# Altium project bigpine.PrjPCB (part 1 of 2)
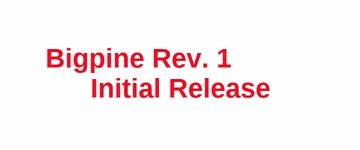
[diagram p0: 01-main.SchDoc]
Client: Amaya Tech, Inc.; ClientAddress: Lafayette, California; ClientProject: Big Pine Main PCB; Company: Amaya Tech, Inc.; CompanyAddress: Lafayette, California; CompanyEmail: joel@amaya.tech
14 sheets, 199 parts. Net scope: global (net labels, ports and power ports of the same name join across sheets).
Board file: bigpine.PcbDoc
Sheets:
  01-main.SchDoc
  02-mcu0.SchDoc
  03-mcu1.SchDoc
  04-mcu2.SchDoc
  05-mcu3.SchDoc
  14-misc.SchDoc
  13-connectors.SchDoc
  06-modem0.SchDoc
  10-power.SchDoc
  11-mppt.SchDoc
  12-sdcard.SchDoc
  07-modem1.SchDoc
  08-modem2.SchDoc
  09-modem3.SchDoc

## Sheet 01-main.SchDoc: Main
size Letter; DrawnBy: J. Brinton; Engineer: J. Brinton; Revision: 1; SheetNumber: 1; SheetTotal: 14

### Notes on the sheet
- Bigpine Rev. 1
- Initial Release
- Designed By:
- Title
- Engineer
- Revision
- Drawn By
- Date
- Sheet
- of

## Sheet 02-mcu0.SchDoc: MCU
size Letter; DrawnBy: J. Brinton; Engineer: J. Brinton; Revision: 1; SheetNumber: 2; SheetTotal: 14
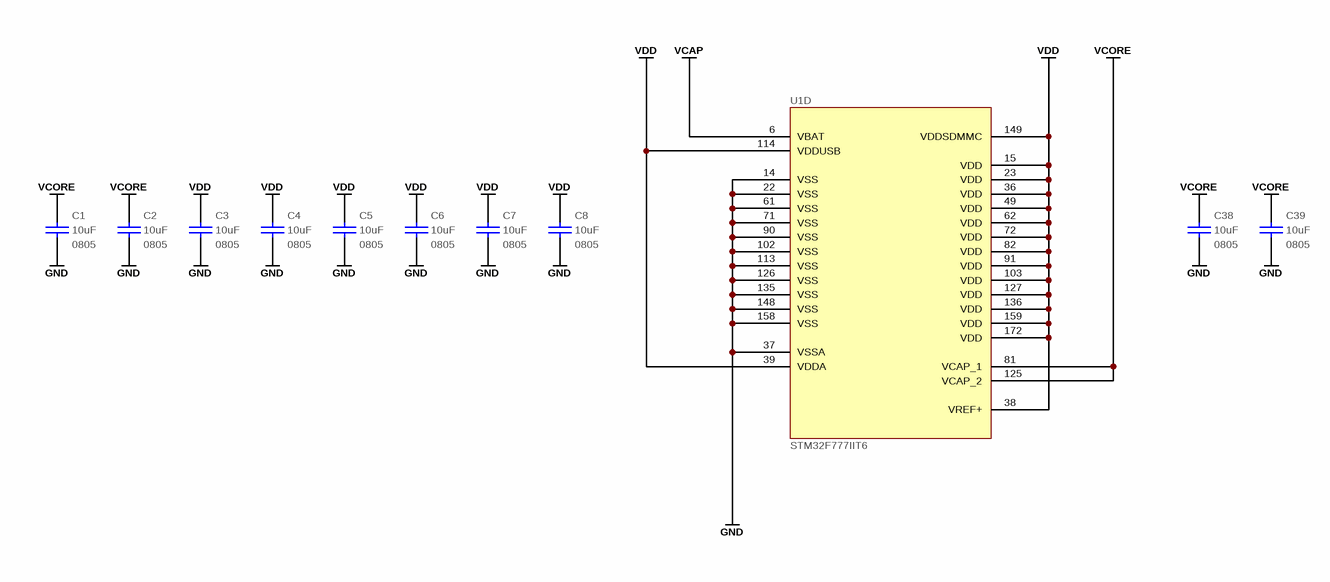
[diagram p1: 02-mcu0.SchDoc]

### Parts
C1  value 10uF  Package: 0805  [CAPC200X125X145L45N]  (hidden comment: CL21B106KOQNNNE)
C2  value 10uF  Package: 0805  [CAPC200X125X145L45N]  (hidden comment: CL21B106KOQNNNE)
C3  value 10uF  Package: 0805  [CAPC200X125X145L45N]  (hidden comment: CL21B106KOQNNNE)
C4  value 10uF  Package: 0805  [CAPC200X125X145L45N]  (hidden comment: CL21B106KOQNNNE)
C5  value 10uF  Package: 0805  [CAPC200X125X145L45N]  (hidden comment: CL21B106KOQNNNE)
C6  value 10uF  Package: 0805  [CAPC200X125X145L45N]  (hidden comment: CL21B106KOQNNNE)
C7  value 10uF  Package: 0805  [CAPC200X125X145L45N]  (hidden comment: CL21B106KOQNNNE)
C8  value 10uF  Package: 0805  [CAPC200X125X145L45N]  (hidden comment: CL21B106KOQNNNE)
C38  value 10uF  Package: 0805  [CAPC200X125X145L45N]  (hidden comment: CL21B106KOQNNNE)
C39  value 10uF  Package: 0805  [CAPC200X125X145L45N]  (hidden comment: CL21B106KOQNNNE)
U1  STM32F777IIT6  [TSQFP50P2600X2600X160-176N]  (part D of 4)

### Nets
GND: C1.2 C2.2 C3.2 C4.2 C5.2 C6.2 C7.2 C8.2 C38.2 C39.2 U1.14(VSS) U1.22(VSS) U1.37(VSSA) U1.61(VSS) U1.71(VSS) U1.90(VSS) U1.102(VSS) U1.113(VSS) U1.126(VSS) U1.135(VSS) U1.148(VSS) U1.158(VSS)
VCAP: U1.6(VBAT)
VCORE: C1.1 C2.1 C38.1 C39.1 U1.81(VCAP_1) U1.125(VCAP_2)
VDD: C3.1 C4.1 C5.1 C6.1 C7.1 C8.1 U1.15(VDD) U1.23(VDD) U1.36(VDD) U1.38(VREF+) U1.39(VDDA) U1.49(VDD) U1.62(VDD) U1.72(VDD) U1.82(VDD) U1.91(VDD) U1.103(VDD) U1.114(VDDUSB) U1.127(VDD) U1.136(VDD) U1.149(VDDSDMMC) U1.159(VDD) U1.172(VDD)

### Notes on the sheet
- Designed By:
- Title
- Engineer
- Revision
- Drawn By
- Date
- Sheet
- of

### Library data of the parts
C1-C8 C38 C39 = LMK212B7106KG: Ceramic Capacitor 10uF ±10% 16V X7R 0805; Manufacturer: Samsung; Tr: -55:105; Manufacturer P/N: CL21B106KOQNNNE; Tolerance: ±10%; Voltage: 16V
U1 = STM32F777IIT: Microcontroller; Manufacturer: STMicroelectronics; Manufacturer P/N: STM32F777IIT6

## Sheet 03-mcu1.SchDoc: MCU
size Letter; DrawnBy: J. Brinton; Engineer: J. Brinton; Revision: 1; SheetNumber: 3; SheetTotal: 14
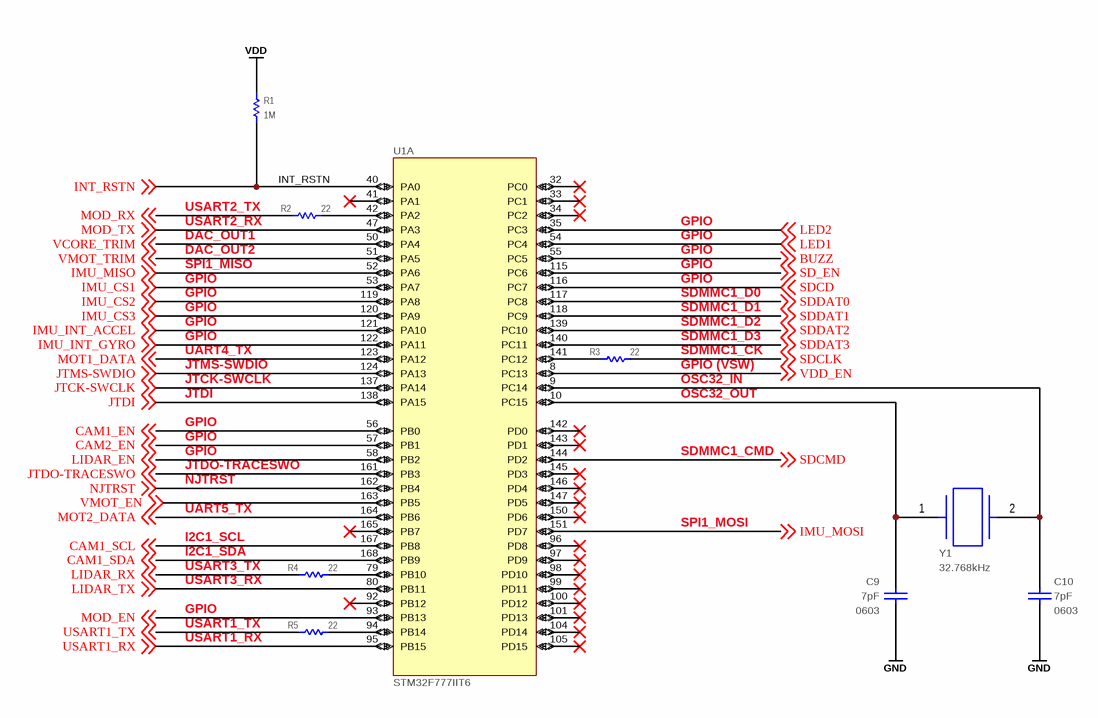
[diagram p2: 03-mcu1.SchDoc]

### Parts
C9  value 7pF  Package: 0603  [CAPC160X80X90L20N]  (hidden comment: CL10C070CB8NNNC)
C10  value 7pF  Package: 0603  [CAPC160X80X90L20N]  (hidden comment: CL10C070CB8NNNC)
R1  value 1M  [RESC2012X70N]  (hidden comment: ERJ-6ENF1004V)
R2  value 22  [RESC2012X70N]  (hidden comment: ERJ-6ENF22R0V)
R3  value 22  [RESC2012X70N]  (hidden comment: ERJ-6ENF22R0V)
R4  value 22  [RESC2012X70N]  (hidden comment: ERJ-6ENF22R0V)
R5  value 22  [RESC2012X70N]  (hidden comment: ERJ-6ENF22R0V)
U1  STM32F777IIT6  [TSQFP50P2600X2600X160-176N]  (part A of 4)
Y1  Frequency: 32.768kHz  [ABS07]  (hidden comment: ABS07-32.768KHZ-7)

### Nets
GND: C9.1 C10.1
VDD: R1.2
BUZZ: U1.55(PC5) ; off-sheet BUZZ
CAM1_EN: U1.56(PB0) ; off-sheet CAM1_EN
CAM1_SCL: U1.167(PB8) ; off-sheet CAM1_SCL
CAM1_SDA: U1.168(PB9) ; off-sheet CAM1_SDA
CAM2_EN: U1.57(PB1) ; off-sheet CAM2_EN
IMU_CS1: U1.53(PA7) ; off-sheet IMU_CS1
IMU_CS2: U1.119(PA8) ; off-sheet IMU_CS2
IMU_CS3: U1.120(PA9) ; off-sheet IMU_CS3
IMU_INT_ACCEL: U1.121(PA10) ; off-sheet IMU_INT_ACCEL
IMU_INT_GYRO: U1.122(PA11) ; off-sheet IMU_INT_GYRO
IMU_MISO: U1.52(PA6) ; off-sheet IMU_MISO
IMU_MOSI: U1.151(PD7) ; off-sheet IMU_MOSI
INT_RSTN: R1.1 U1.40(PA0) ; off-sheet INT_RSTN
JTCK-SWCLK: U1.137(PA14) ; off-sheet JTCK-SWCLK
JTDI: U1.138(PA15) ; off-sheet JTDI
JTDO-TRACESWO: U1.161(PB3) ; off-sheet JTDO-TRACESWO
JTMS-SWDIO: U1.124(PA13) ; off-sheet JTMS-SWDIO
LED1: U1.54(PC4) ; off-sheet LED1
LED2: U1.35(PC3) ; off-sheet LED2
LIDAR_EN: U1.58(PB2) ; off-sheet LIDAR_EN
LIDAR_RX: R4.2 ; off-sheet LIDAR_RX
LIDAR_TX: U1.80(PB11) ; off-sheet LIDAR_TX
MOD_EN: U1.93(PB13) ; off-sheet MOD_EN
MOD_RX: R2.2 ; off-sheet MOD_RX
MOD_TX: U1.47(PA3) ; off-sheet MOD_TX
MOT1_DATA: U1.123(PA12) ; off-sheet MOT1_DATA
MOT2_DATA: U1.164(PB6) ; off-sheet MOT2_DATA
NJTRST: U1.162(PB4) ; off-sheet NJTRST
SD_EN: U1.115(PC6) ; off-sheet SD_EN
SDCD: U1.116(PC7) ; off-sheet SDCD
SDCLK: R3.1 ; off-sheet SDCLK
SDCMD: U1.144(PD2) ; off-sheet SDCMD
SDDAT0: U1.117(PC8) ; off-sheet SDDAT0
SDDAT1: U1.118(PC9) ; off-sheet SDDAT1
SDDAT2: U1.139(PC10) ; off-sheet SDDAT2
SDDAT3: U1.140(PC11) ; off-sheet SDDAT3
USART1_RX: U1.95(PB15) ; off-sheet USART1_RX
USART1_TX: R5.2 ; off-sheet USART1_TX
VCORE_TRIM: U1.50(PA4) ; off-sheet VCORE_TRIM
VDD_EN: U1.8(PC13) ; off-sheet VDD_EN
VMOT_EN: U1.163(PB5) ; off-sheet VMOT_EN
VMOT_TRIM: U1.51(PA5) ; off-sheet VMOT_TRIM
NetC9_2: C9.2 U1.10(PC15) Y1.1(XTAL1)
NetC10_2: C10.2 U1.9(PC14) Y1.2(XTAL2)
NetR2_1: R2.1 U1.42(PA2)
NetR3_2: R3.2 U1.141(PC12)
NetR4_1: R4.1 U1.79(PB10)
NetR5_1: R5.1 U1.94(PB14)

Not connected (* = marked no-connect by the designer): U1 32(PC0)* 33(PC1)* 34(PC2)* 41(PA1)* 92(PB12)* 96(PD8)* 97(PD9)* 98(PD10)* 99(PD11)* 100(PD12)* 101(PD13)* 104(PD14)* 105(PD15)* 142(PD0)* 143(PD1)* 145(PD3)* 146(PD4)* 147(PD5)* 150(PD6)* 165(PB7)*

### Notes on the sheet
- (near R2) USART2_TX
- (near R2) USART2_RX
- DAC_OUT1
- DAC_OUT2
- GPIO
- SPI1_MISO
- SDMMC1_D0
- SDMMC1_D1
- SDMMC1_D2
- JTMS-SWDIO
- JTCK-SWCLK
- JTDI
- UART4_TX
- (near R3) SDMMC1_D3
- (near R3) SDMMC1_CK
- (near R3) GPIO (VSW)
- (near R3) OSC32_IN
- OSC32_OUT
- JTDO-TRACESWO
- SDMMC1_CMD
- NJTRST
- UART5_TX
- I2C1_SCL
- SPI1_MOSI
- USART3_TX
- USART3_RX
- I2C1_SDA
- USART1_TX
- USART1_RX
- Designed By:
- Title
- Engineer
- Revision
- Drawn By
- Date
- Sheet
- of

### Library data of the parts
C9 C10 = CAP: Ceramic Capacitor 7pF +/-0.25pF 0603; Manufacturer: Samsung; Tr: -55:125; Voltage: 50V; Manufacturer P/N: CL10C070CB8NNNC; Tolerance: +/-0.25pF
R1 = RES 0402: Thick Film Resistor 1M ±1% 0805; Manufacturer: Panasonic; Tr: -55:155; Package: 0805; Manufacturer P/N: ERJ-6ENF1004V; Tolerance: ±1%
R2-R5 = RES 0402: Thick Film Resistor 22 ±1% 0805; Manufacturer: Panasonic; Tr: -55:155; Package: 0805; Manufacturer P/N: ERJ-6ENF22R0V; Tolerance: ±1%
U1 = STM32F777IIT: as U1 on sheet 02-mcu0; Manufacturer P/N: STM32F777IIT6
Y1 = ABS07-32.768KHZ-7: CRYSTAL 32.7680KHZ 7PF SMD; Manufacturer: Abracon LLC; Manufacturer P/N: ABS07-32.768KHZ-7-T; Operating Mode: Fundamental; Frequency Tolerance: ±20ppm; ESR (Equivalent Series Resistance): 70 kOhm; Size / Dimension: 0.126" L x 0.059" W (3.20mm x 1.50mm); Mounting Type: Surface Mount; Height: 0.035" (0.90mm); Package / Case: 2-SMD; Operating Temperature: -40°C ~ 85°C; Load Capacitance: 7pF; Type: kHz Crystal (Tuning Fork); RoHS: RoHS Compliant; ComponentLink1URL: http://www.abracon.com/Resonators/ABS07.pdf; ComponentLink1Description: Series Datasheet

## Sheet 04-mcu2.SchDoc: MCU
size Letter; DrawnBy: J. Brinton; Engineer: J. Brinton; Revision: 1; SheetNumber: 4; SheetTotal: 14
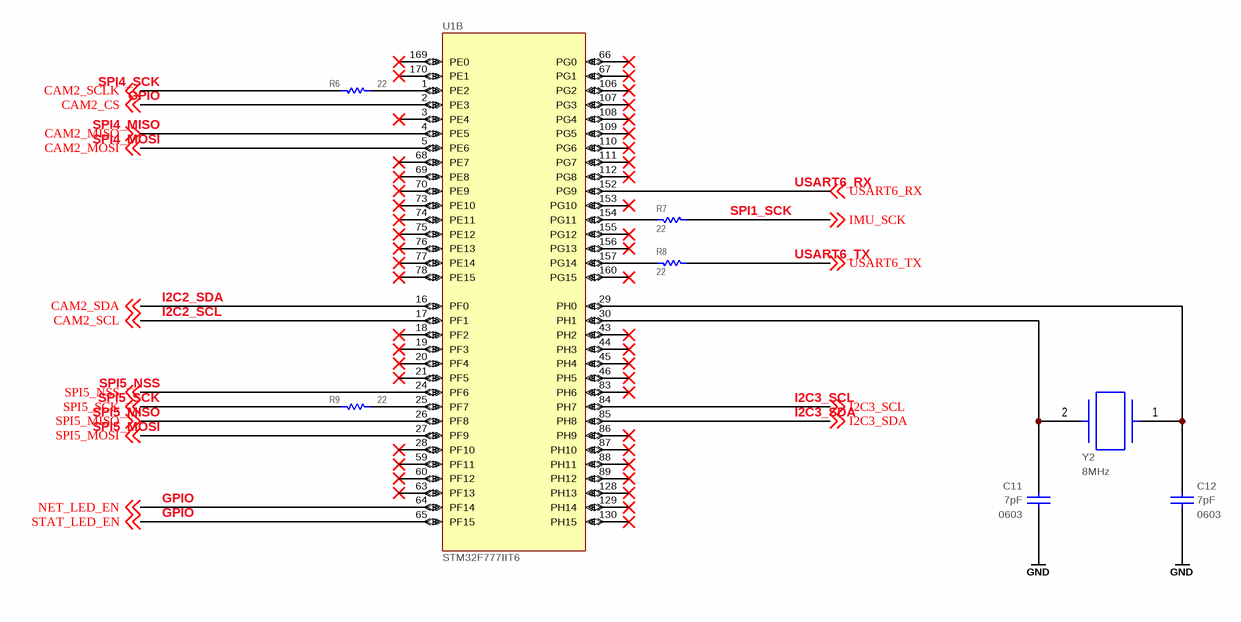
[diagram p3: 04-mcu2.SchDoc]

### Parts
C11  value 7pF  Package: 0603  [CAPC160X80X90L20N]  (hidden comment: CL10C070CB8NNNC)
C12  value 7pF  Package: 0603  [CAPC160X80X90L20N]  (hidden comment: CL10C070CB8NNNC)
R6  value 22  [RESC2012X70N]  (hidden comment: ERJ-6ENF22R0V)
R7  value 22  [RESC2012X70N]  (hidden comment: ERJ-6ENF22R0V)
R8  value 22  [RESC2012X70N]  (hidden comment: ERJ-6ENF22R0V)
R9  value 22  [RESC2012X70N]  (hidden comment: ERJ-6ENF22R0V)
U1  STM32F777IIT6  [TSQFP50P2600X2600X160-176N]  (part B of 4)
Y2  Frequency: 8MHz  [ABLS]  (hidden comment: ABLS-8.000MHZ-B2-T)

### Nets
GND: C11.1 C12.1
CAM2_CS: U1.2(PE3) ; off-sheet CAM2_CS
CAM2_MISO: U1.4(PE5) ; off-sheet CAM2_MISO
CAM2_MOSI: U1.5(PE6) ; off-sheet CAM2_MOSI
CAM2_SCL: U1.17(PF1) ; off-sheet CAM2_SCL
CAM2_SCLK: R6.1 ; off-sheet CAM2_SCLK
CAM2_SDA: U1.16(PF0) ; off-sheet CAM2_SDA
I2C3_SCL: U1.84(PH7) ; off-sheet I2C3_SCL
I2C3_SDA: U1.85(PH8) ; off-sheet I2C3_SDA
IMU_SCK: R7.2 ; off-sheet IMU_SCK
NET_LED_EN: U1.64(PF14) ; off-sheet NET_LED_EN
SPI5_MISO: U1.26(PF8) ; off-sheet SPI5_MISO
SPI5_MOSI: U1.27(PF9) ; off-sheet SPI5_MOSI
SPI5_NSS: U1.24(PF6) ; off-sheet SPI5_NSS
SPI5_SCK: R9.1 ; off-sheet SPI5_SCK
STAT_LED_EN: U1.65(PF15) ; off-sheet STAT_LED_EN
USART6_RX: U1.152(PG9) ; off-sheet USART6_RX
USART6_TX: R8.2 ; off-sheet USART6_TX
NetC11_2: C11.2 U1.30(PH1) Y2.2(XTAL2)
NetC12_2: C12.2 U1.29(PH0) Y2.1(XTAL1)
NetR6_2: R6.2 U1.1(PE2)
NetR7_1: R7.1 U1.154(PG11)
NetR8_1: R8.1 U1.157(PG14)
NetR9_2: R9.2 U1.25(PF7)

Not connected (* = marked no-connect by the designer): U1 3(PE4)* 18(PF2)* 19(PF3)* 20(PF4)* 21(PF5)* 28(PF10)* 43(PH2)* 44(PH3)* 45(PH4)* 46(PH5)* 59(PF11)* 60(PF12)* 63(PF13)* 66(PG0)* 67(PG1)* 68(PE7)* 69(PE8)* 70(PE9)* 73(PE10)* 74(PE11)* 75(PE12)* 76(PE13)* 77(PE14)* 78(PE15)* 83(PH6)* 86(PH9)* 87(PH10)* 88(PH11)* 89(PH12)* 106(PG2)* 107(PG3)* 108(PG4)* 109(PG5)* 110(PG6)* 111(PG7)* 112(PG8)* 128(PH13)* 129(PH14)* 130(PH15)* 153(PG10)* 155(PG12)* 156(PG13)* 160(PG15)* 169(PE0)* 170(PE1)*

### Notes on the sheet
- SPI4_SCK
- GPIO
- SPI4_MISO
- SPI4_MOSI
- USART6_RX
- SPI1_SCK
- USART6_TX
- I2C2_SDA
- I2C2_SCL
- SPI5_NSS
- SPI5_SCK
- I2C3_SCL
- SPI5_MISO
- SPI5_MOSI
- I2C3_SDA
- Designed By:
- Title
- Engineer
- Revision
- Drawn By
- Date
- Sheet
- of

### Library data of the parts
C11 C12 = CAP: as C9 on sheet 03-mcu1; Manufacturer P/N: CL10C070CB8NNNC; Tolerance: +/-0.25pF
R6-R9 = RES 0402: as R2 on sheet 03-mcu1; Package: 0805; Manufacturer P/N: ERJ-6ENF22R0V; Tolerance: ±1%
U1 = STM32F777IIT: as U1 on sheet 02-mcu0; Manufacturer P/N: STM32F777IIT6
Y2 = ABLS-8.000MHZ-B2-T: CRYSTAL 8MHZ 18PF SMD; Manufacturer: Abracon LLC; Frequency Tolerance: ±20ppm; package: 2-SMD; Load Capacitance: 18pF; ComponentLink1URL: http://www.abracon.com/Resonators/ABS07.pdf; ComponentLink1Description: Series Datasheet; Manufacturer P/N: ABLS-8.000MHZ-B2-T

## Sheet 05-mcu3.SchDoc: MCU
size Letter; DrawnBy: J. Brinton; Engineer: J. Brinton; Revision: 1; SheetNumber: 5; SheetTotal: 14
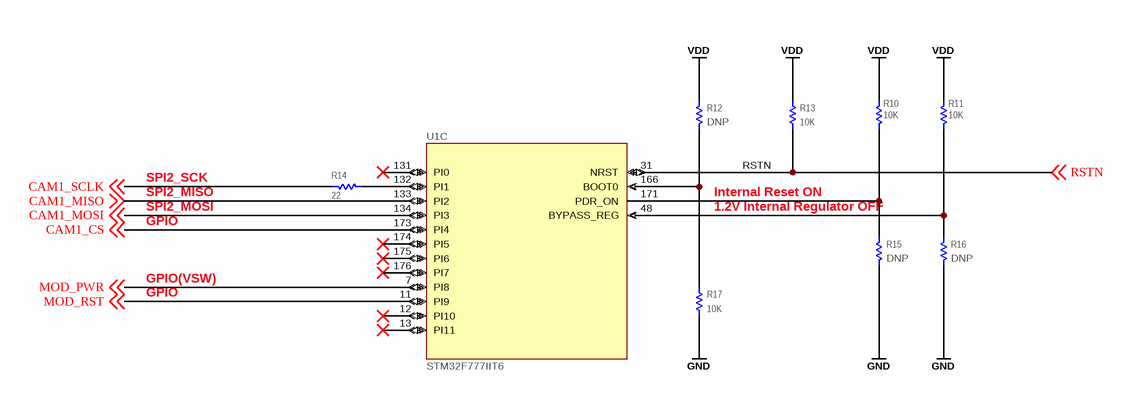
[diagram p4: 05-mcu3.SchDoc]

### Parts
R10  value 10K  [RESC2012X70N]  (hidden comment: ERJ-6ENF1002V)
R11  value 10K  [RESC2012X70N]  (hidden comment: ERJ-6ENF1002V)
R12  Do Not Place: DNP  [RESC2012X70N]  (hidden comment: ERJ-6ENF1002V)
R13  value 10K  [RESC2012X70N]  (hidden comment: ERJ-6ENF1002V)
R14  value 22  [RESC2012X70N]  (hidden comment: ERJ-6ENF22R0V)
R15  Do Not Place: DNP  [RESC2012X70N]  (hidden comment: ERJ-6ENF1002V)
R16  Do Not Place: DNP  [RESC2012X70N]  (hidden comment: ERJ-6ENF1002V)
R17  value 10K  [RESC2012X70N]  (hidden comment: ERJ-6ENF1002V)
U1  STM32F777IIT6  [TSQFP50P2600X2600X160-176N]  (part C of 4)

### Nets
GND: R15.1 R16.1 R17.1
VDD: R10.2 R11.2 R12.2 R13.2
CAM1_CS: U1.173(PI4) ; off-sheet CAM1_CS
CAM1_MISO: U1.133(PI2) ; off-sheet CAM1_MISO
CAM1_MOSI: U1.134(PI3) ; off-sheet CAM1_MOSI
CAM1_SCLK: R14.1 ; off-sheet CAM1_SCLK
MOD_PWR: U1.7(PI8) ; off-sheet MOD_PWR
MOD_RST: U1.11(PI9) ; off-sheet MOD_RST
RSTN: R13.1 U1.31(NRST) ; off-sheet RSTN
NetR10_1: R10.1 R15.2 U1.171(PDR_ON)
NetR11_1: R11.1 R16.2 U1.48(BYPASS_REG)
NetR12_1: R12.1 R17.2 U1.166(BOOT0)
NetR14_2: R14.2 U1.132(PI1)

Not connected (* = marked no-connect by the designer): U1 12(PI10)* 13(PI11)* 131(PI0)* 174(PI5)* 175(PI6)* 176(PI7)*

### Notes on the sheet
- SPI2_MISO
- SPI2_MOSI
- SPI2_SCK
- GPIO
- (near R15) 1.2V Internal Regulator OFF
- Internal Reset ON
- GPIO(VSW)
- Designed By:
- Title
- Engineer
- Revision
- Drawn By
- Date
- Sheet
- of

### Library data of the parts
R10-R13 R15-R17 = RES 0402: Thick Film Resistor 10k ±1% 0805; Manufacturer: Panasonic; Tr: -55:155; Package: 0805; Manufacturer P/N: ERJ-6ENF1002V; Tolerance: ±1%
  R12 R15 R16: Value: 10K
R14 = RES 0402: as R2 on sheet 03-mcu1; Package: 0805; Manufacturer P/N: ERJ-6ENF22R0V; Tolerance: ±1%
U1 = STM32F777IIT: as U1 on sheet 02-mcu0; Manufacturer P/N: STM32F777IIT6

## Sheet 14-misc.SchDoc: Miscellaneous
size Letter; DrawnBy: J. Brinton; Engineer: J. Brinton; Revision: 1; SheetNumber: 14; SheetTotal: 14
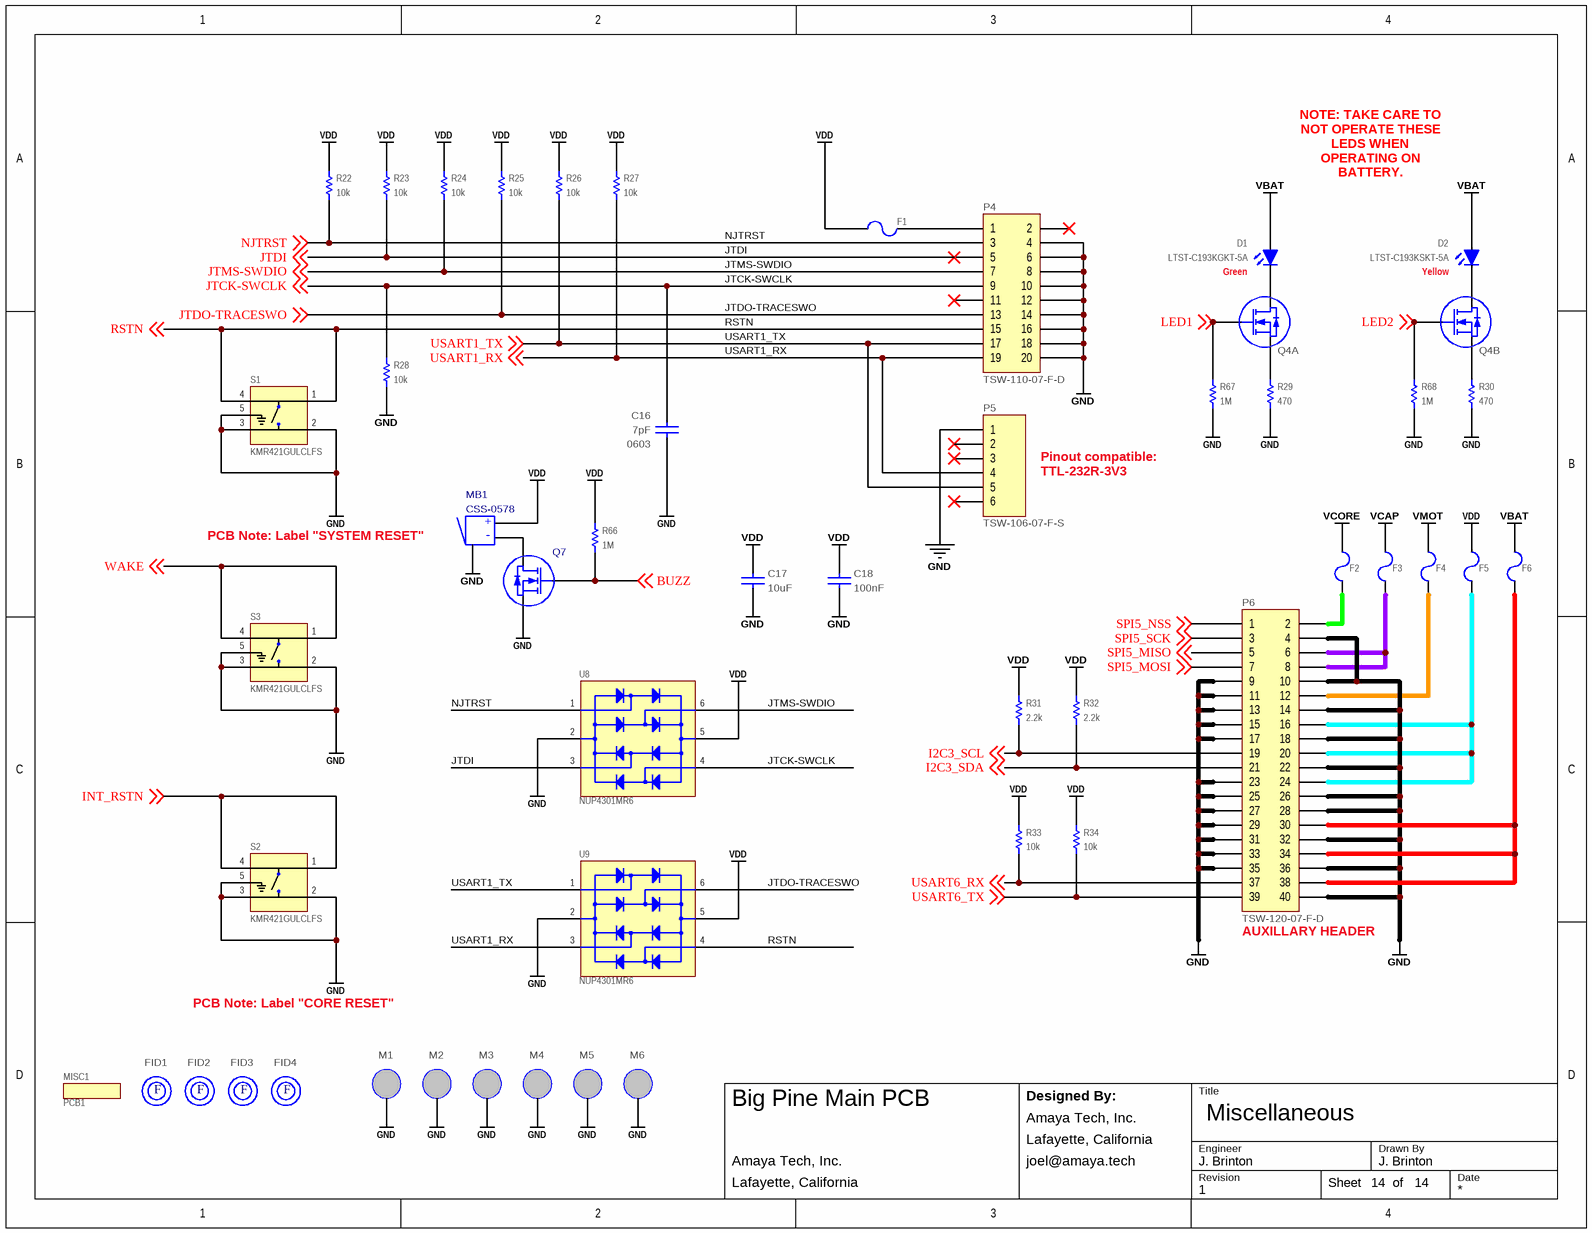
[diagram p5: 14-misc.SchDoc]

### Parts
C16  value 7pF  Package: 0603  [CAPC160X80X90L20N]  (hidden comment: CL10C070CB8NNNC)
C17  value 10uF  [CAPC200X125X145L45N]  (hidden comment: CL21B106KOQNNNE)
C18  value 100nF  [CAPC200X125X145L45N]  (hidden comment: GCM21BR71H104KA37L)
D1  LTST-C193KGKT-5A  [0603_LED]
D2  LTST-C193KSKT-5A  [0603_LED]
F1  0ZCJ0020FF2E  [1206]  (value not drawn)
F2  0ZCJ0020FF2E  [1206]  (value not drawn)
F3  0ZCJ0020FF2E  [1206]  (value not drawn)
F4  0ZCJ0020FF2E  [1206]  (value not drawn)
F5  0ZCJ0020FF2E  [1206]  (value not drawn)
F6  0ZCJ0020FF2E  [1206]  (value not drawn)
FID1  FIDUCIAL  [fiducial1mm]  (value not drawn)  (no BOM)
FID2  FIDUCIAL  [fiducial1mm]  (value not drawn)  (no BOM)
FID3  FIDUCIAL  [fiducial1mm]  (value not drawn)  (no BOM)
FID4  FIDUCIAL  [fiducial1mm]  (value not drawn)  (no BOM)
M1  MOUNT  [M4_MOUNT]  (value not drawn)  (no BOM)
M2  MOUNT  [M4_MOUNT]  (value not drawn)  (no BOM)
M3  MOUNT  [M4_MOUNT]  (value not drawn)  (no BOM)
M4  MOUNT  [M4_MOUNT]  (value not drawn)  (no BOM)
M5  MOUNT  [M4_MOUNT]  (value not drawn)  (no BOM)
M6  MOUNT  [M4_MOUNT]  (value not drawn)  (no BOM)
MB1  CSS-0578  [CSS-0578]
MISC1  PCB1
P4  TSW-110-07-F-D  [TSW-110-07-F-D]
P5  TSW-106-07-F-S  [TSW-106-07-F-S]
P6  TSW-120-07-F-D  [TSW-120-07-F-D]
Q4  UM6K34NTCN  [SOT363]  (value not drawn)  (parts A,B of 2)
Q7  2N7002W-7-F  [SOT323]  (value not drawn)
R22  value 10k  [RESC2012X70N]  (hidden comment: ERA-6AEB103V)
R23  value 10k  [RESC2012X70N]  (hidden comment: ERA-6AEB103V)
R24  value 10k  [RESC2012X70N]  (hidden comment: ERA-6AEB103V)
R25  value 10k  [RESC2012X70N]  (hidden comment: ERA-6AEB103V)
R26  value 10k  [RESC2012X70N]  (hidden comment: ERA-6AEB103V)
R27  value 10k  [RESC2012X70N]  (hidden comment: ERA-6AEB103V)
R28  value 10k  [RESC2012X70N]  (hidden comment: ERA-6AEB103V)
R29  value 470  [RESC2012X70N]  (hidden comment: ERJ-6ENF4700V)
R30  value 470  [RESC2012X70N]  (hidden comment: ERJ-6ENF4700V)
R31  value 2.2k  [RESC2012X70N]  (hidden comment: ERA-6AEB222V)
R32  value 2.2k  [RESC2012X70N]  (hidden comment: ERA-6AEB222V)
R33  value 10k  [RESC2012X70N]  (hidden comment: ERA-6AEB103V)
R34  value 10k  [RESC2012X70N]  (hidden comment: ERA-6AEB103V)
R66  value 1M  [RESC2012X70N]  (hidden comment: ERJ-6ENF1004V)
R67  value 1M  [RESC2012X70N]  (hidden comment: ERJ-6ENF1004V)
R68  value 1M  [RESC2012X70N]  (hidden comment: ERJ-6ENF1004V)
S1  KMR421GULCLFS  [SW_KMR421GULCLFS]
S2  KMR421GULCLFS  [SW_KMR421GULCLFS]
S3  KMR421GULCLFS  [SW_KMR421GULCLFS]
U8  NUP4301MR6  [SOT23-6]
U9  NUP4301MR6  [SOT23-6]

### Nets
GND: C16.1 C17.2 C18.2 M1.1(MNT) M2.1(MNT) M3.1(MNT) M4.1(MNT) M5.1(MNT) M6.1(MNT) MB1.3(TAB) P4.4 P4.6 P4.8 P4.10 P4.12 P4.14 P4.16 P4.18 P4.20 P5.1 P6.4 P6.9 P6.10 P6.11 P6.13 P6.14 P6.15 P6.17 P6.18 P6.22 P6.23 P6.25 P6.26 P6.27 P6.28 P6.29 P6.31 P6.32 P6.33 P6.35 P6.36 P6.40 Q7.2(S) R28.1 R29.1 R30.1 R67.1 R68.1 S1.2 S1.3 S1.5(G) S2.2 S2.3 S2.5(G) S3.2 S3.3 S3.5(G) U8.2(VN) U9.2(VN)
VBAT: D1.1(A) D2.1(A) F6.1
VCAP: F3.1
VCORE: F2.1
VDD: C17.1 C18.1 F1.1 F5.1 MB1.1(POS) R22.2 R23.2 R24.2 R25.2 R26.2 R27.2 R31.2 R32.2 R33.2 R34.2 R66.2 U8.5(VP) U9.5(VP)
VMOT: F4.1
BUZZ: Q7.1(G) R66.1 ; off-sheet BUZZ
I2C3_SCL: P6.19 R31.1 ; off-sheet I2C3_SCL
I2C3_SDA: P6.21 R32.1 ; off-sheet I2C3_SDA
INT_RSTN: S2.1 S2.4 ; off-sheet INT_RSTN
JTCK-SWCLK: C16.2 P4.9 R28.2 U8.4(C) ; off-sheet JTCK-SWCLK
JTDI: P4.5 R23.1 U8.3(B) ; off-sheet JTDI
JTDO-TRACESWO: P4.13 R25.1 U9.6(D) ; off-sheet JTDO-TRACESWO
JTMS-SWDIO: P4.7 R24.1 U8.6(D) ; off-sheet JTMS-SWDIO
LED1: Q4.5(G1) R67.2 ; off-sheet LED1
LED2: Q4.2(G2) R68.2 ; off-sheet LED2
NJTRST: P4.3 R22.1 U8.1(A) ; off-sheet NJTRST
RSTN: P4.15 S1.1 S1.4 U9.4(C) ; off-sheet RSTN
SPI5_MISO: P6.5 ; off-sheet SPI5_MISO
SPI5_MOSI: P6.7 ; off-sheet SPI5_MOSI
SPI5_NSS: P6.1 ; off-sheet SPI5_NSS
SPI5_SCK: P6.3 ; off-sheet SPI5_SCK
USART1_RX: P4.19 P5.4 R27.1 U9.3(B) ; off-sheet USART1_RX
USART1_TX: P4.17 P5.5 R26.1 U9.1(A) ; off-sheet USART1_TX
USART6_RX: P6.37 R33.1 ; off-sheet USART6_RX
USART6_TX: P6.39 R34.1 ; off-sheet USART6_TX
WAKE: S3.1 S3.4 ; off-sheet WAKE
NetD1_2: D1.2(K) Q4.3(D1)
NetD2_2: D2.2(K) Q4.6(D2)
NetF1_2: F1.2 P4.1
NetF2_2: F2.2 P6.2
NetF3_2: F3.2 P6.6 P6.8
NetF4_2: F4.2 P6.12
NetF5_2: F5.2 P6.16 P6.20 P6.24
NetF6_2: F6.2 P6.30 P6.34 P6.38
NetMB1_2: MB1.2(NEG) Q7.3(D)
NetQ4_1: Q4.1(S2) R30.2
NetQ4_4: Q4.4(S1) R29.2

Not connected (* = marked no-connect by the designer): P4 2* 11*; P5 2* 3* 6*

### Notes on the sheet
- NOTE: TAKE CARE TO NOT OPERATE THESE LEDS WHEN OPERATING ON BATTERY.
- Green
- Yellow
- Pinout compatible:
- PCB Note: Label "SYSTEM RESET"
- TTL-232R-3V3
- (near P6) AUXILLARY HEADER
- PCB Note: Label "CORE RESET"
- Designed By:
- Title
- Engineer
- Revision
- Drawn By
- Date
- Sheet
- of
- (in symbol CSS-0578) +; -
- (in symbol FIDUCIAL) F

### Library data of the parts
C16 = CAP: as C9 on sheet 03-mcu1; Manufacturer P/N: CL10C070CB8NNNC; Tolerance: +/-0.25pF
C17 = LMK212B7106KG: as C1 on sheet 02-mcu0; Manufacturer P/N: CL21B106KOQNNNE; Tolerance: ±10%; Package: 0805; Voltage: 16V
C18 = TMK212B7105KG: Ceramic Capacitor 100nF ±10% 50V X7R 0805; Manufacturer: Murata; Tr: -55:125; Manufacturer P/N: GCM21BR71H104KA37L; Tolerance: ±10%; Package: 0805; Voltage: 50V
D1 = LED0603Y: LED, SMT 0603, Color Green, 5mA, 2V; Manufacturer: Lite-On; Manufacturer P/N: LTST-C193KGKT-5A; Package: 0603 Polarized
D2 = LED0603Y: LED, SMT 0603, Color Yellow, 5mA, 2.9V; Manufacturer: Panasonic; Manufacturer P/N: LTST-C193KSKT-5A; Package: 0603 Polarized
F1-F6 = 0ZCJ0020FF2E: PTC Resettable Fuse, 0.2A, 30V, SMD 1206; Manufacturer: Bell Fuse; Manufacturer P/N: 0ZCJ0020FF2E; Package: 1206
MB1 = CSS-0578: Magnetic Buzzer; Manufacturer: CUI, Inc.; Manufacturer P/N: CSS-0578
MISC1 = MISC: Printed Circuit Board; Manufacturer: Aware; Manufacturer P/N: PCB1
P4 = Header 10X2: Header, 10-Pin, Dual row; Manufacturer: Samtec; Manufacturer P/N: TSW-110-07-F-D
P5 = Header 6: Header, 6-Pin; Manufacturer: Samtec; Manufacturer P/N: TSW-106-07-F-S
P6 = Header 20X2: Header, 20-Pin, Dual row; Manufacturer: Samtec; Manufacturer P/N: TSW-120-07-F-D
Q4 = 2N7002DW-7-F: Dual N-Channel Enhancement Mode MOSFET; Manufacturer: Rohm; Tr: -55:150; Manufacturer P/N: UM6K34NTCN; Package: SOT363
Q7 = 2N7002-7-F: N-Channel Enhancement Mode MOSFET; Manufacturer: Diodes, Inc.; Tr: -55:150; Manufacturer P/N: 2N7002W-7-F; Package: SOT363
R22-R28 R33 R34 = RES: Thin Film Resistor 10k ±0.1% 0.125W 100V 0805; Manufacturer: Panasonic; Tcr: ±25; Tr: -55:155; Voltage: 100; Power: 0.125; Tolerance: ±0.1%; Manufacturer P/N: ERA-6AEB103V; Package: 0805
R29 R30 = RES 0402: Thick Film Resistor 470 ±1% 0805; Manufacturer: Panasonic; Tr: -55:155; Package: 0805; Manufacturer P/N: ERJ-6ENF4700V; Tolerance: ±1%
R31 R32 = RES: Thin Film Resistor 2.2k ±0.1% 0.125W 100V 0805; Manufacturer: Panasonic; Tcr: ±25; Tr: -55:155; Voltage: 100; Power: 0.125; Tolerance: ±0.1%; Manufacturer P/N: ERA-6AEB222V; Package: 0805
R66-R68 = RES 0402: as R1 on sheet 03-mcu1; Package: 0805; Manufacturer P/N: ERJ-6ENF1004V; Tolerance: ±1%
S1-S3 = KMR421GULCLFS: Switch Tactile N.O. SPST Round Button Gull Wing 0.05A 32VDC 1VA; Manufacturer: C&K Components; Availability: Good; Package: None; Manufacturer P/N: KMR421GULCLFS; Price: 0.29 USD; Value: *
U8 U9 = NUP4301MR6: 4-Lane TVS Diode Array; Manufacturer: On Semiconductor; Manufacturer P/N: NUP4301MR6
M1-M6 = MOUNT: Manufacturer: *; Manufacturer P/N: *

## Sheet 13-connectors.SchDoc: Connectors
size Letter; DrawnBy: J. Brinton; Engineer: J. Brinton; Revision: 1; SheetNumber: 13; SheetTotal: 14
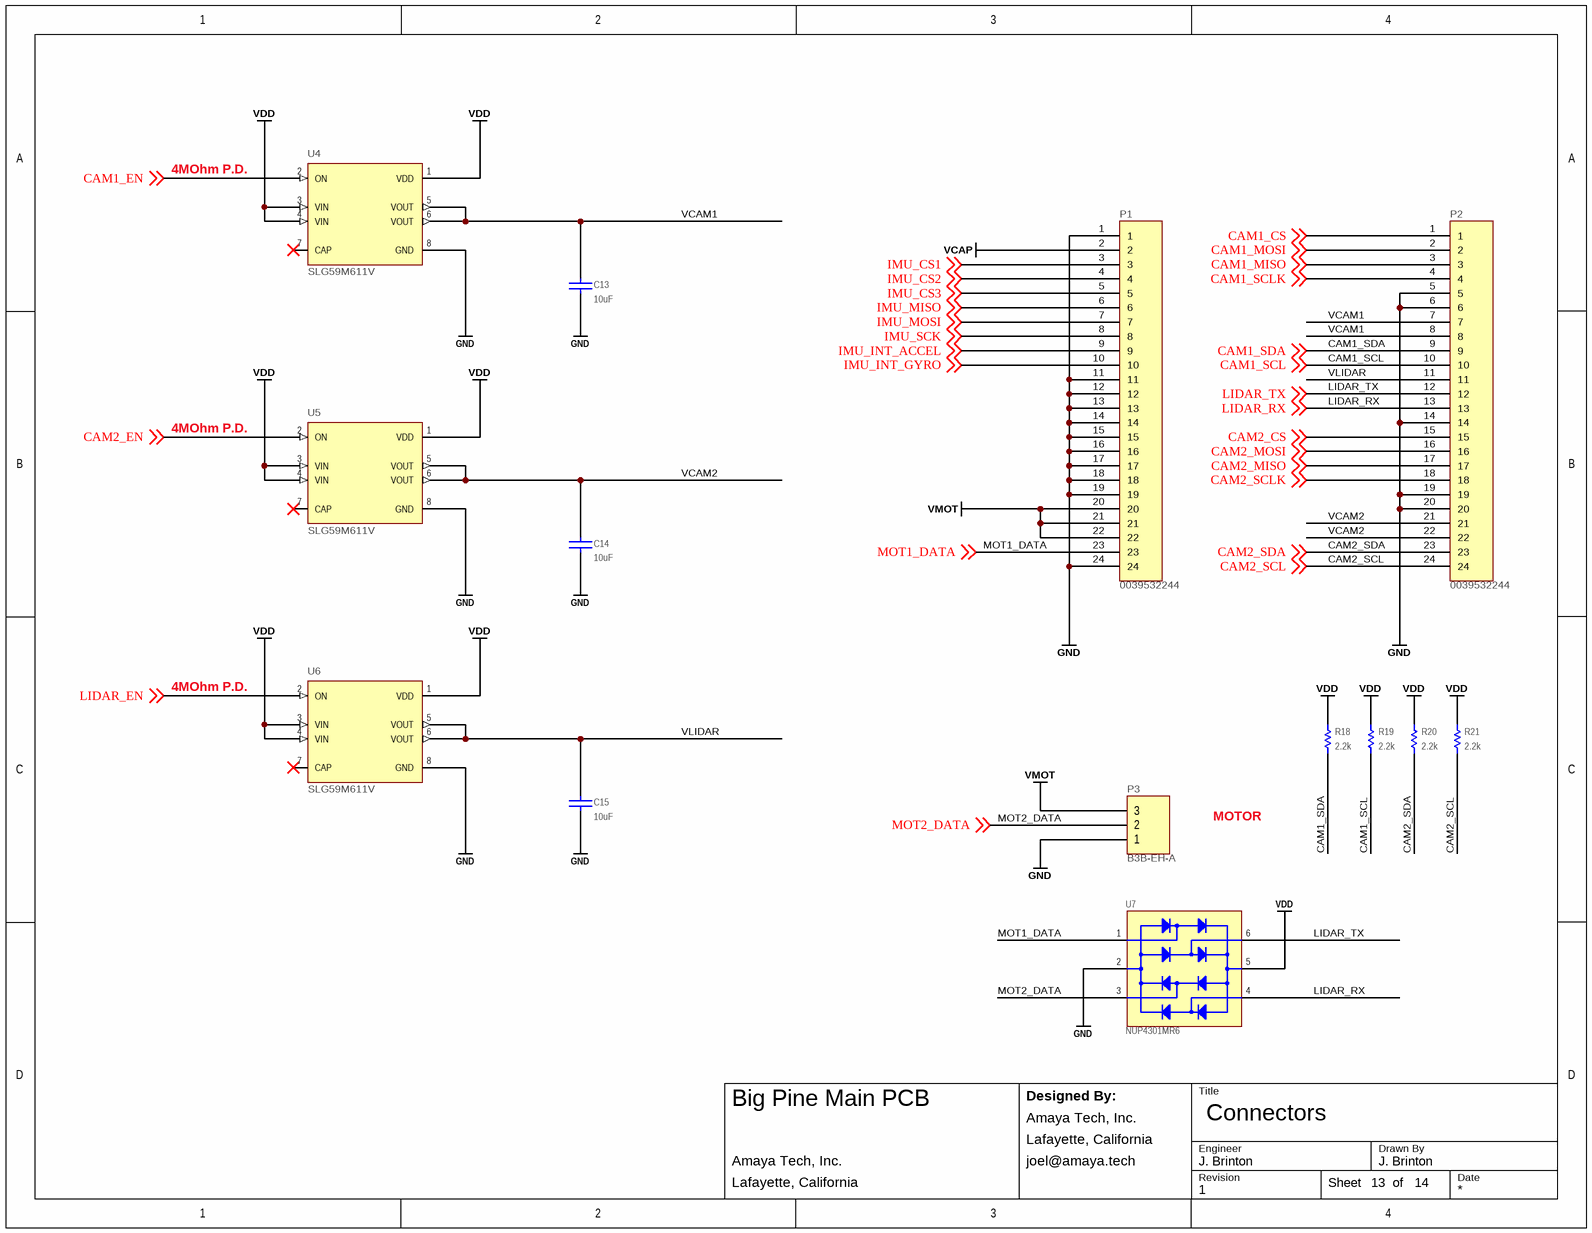
[diagram p6: 13-connectors.SchDoc]

### Parts
C13  value 10uF  [CAPC160X80X90L20N]  (hidden comment: ZRB18AR61E106ME01L)
C14  value 10uF  [CAPC160X80X90L20N]  (hidden comment: ZRB18AR61E106ME01L)
C15  value 10uF  [CAPC160X80X90L20N]  (hidden comment: ZRB18AR61E106ME01L)
P1  0039532244  [0039532244]
P2  0039532244  [0039532244]
P3  B3B-EH-A  [B3B-EH-A]
R18  value 2.2k  [RESC2012X70N]  (hidden comment: ERA-6AEB222V)
R19  value 2.2k  [RESC2012X70N]  (hidden comment: ERA-6AEB222V)
R20  value 2.2k  [RESC2012X70N]  (hidden comment: ERA-6AEB222V)
R21  value 2.2k  [RESC2012X70N]  (hidden comment: ERA-6AEB222V)
U4  SLG59M611V  [DFN200X150X80-8N]
U5  SLG59M611V  [DFN200X150X80-8N]
U6  SLG59M611V  [DFN200X150X80-8N]
U7  NUP4301MR6  [SOT23-6]

### Nets
GND: C13.1 C14.1 C15.1 P1.1 P1.11 P1.12 P1.13 P1.14 P1.15 P1.16 P1.17 P1.18 P1.19 P1.24 P2.5 P2.6 P2.14 P2.19 P2.20 P3.1 U4.8(GND) U5.8(GND) U6.8(GND) U7.2(VN)
VCAP: P1.2
VDD: R18.2 R19.2 R20.2 R21.2 U4.1(VDD) U4.3(VIN) U4.4(VIN) U5.1(VDD) U5.3(VIN) U5.4(VIN) U6.1(VDD) U6.3(VIN) U6.4(VIN) U7.5(VP)
VMOT: P1.20 P1.21 P1.22 P3.3
CAM1_CS: P2.1 ; off-sheet CAM1_CS
CAM1_EN: U4.2(ON) ; off-sheet CAM1_EN
CAM1_MISO: P2.3 ; off-sheet CAM1_MISO
CAM1_MOSI: P2.2 ; off-sheet CAM1_MOSI
CAM1_SCL: P2.10 R19.1 ; off-sheet CAM1_SCL
CAM1_SCLK: P2.4 ; off-sheet CAM1_SCLK
CAM1_SDA: P2.9 R18.1 ; off-sheet CAM1_SDA
CAM2_CS: P2.15 ; off-sheet CAM2_CS
CAM2_EN: U5.2(ON) ; off-sheet CAM2_EN
CAM2_MISO: P2.17 ; off-sheet CAM2_MISO
CAM2_MOSI: P2.16 ; off-sheet CAM2_MOSI
CAM2_SCL: P2.24 R21.1 ; off-sheet CAM2_SCL
CAM2_SCLK: P2.18 ; off-sheet CAM2_SCLK
CAM2_SDA: P2.23 R20.1 ; off-sheet CAM2_SDA
IMU_CS1: P1.3 ; off-sheet IMU_CS1
IMU_CS2: P1.4 ; off-sheet IMU_CS2
IMU_CS3: P1.5 ; off-sheet IMU_CS3
IMU_INT_ACCEL: P1.9 ; off-sheet IMU_INT_ACCEL
IMU_INT_GYRO: P1.10 ; off-sheet IMU_INT_GYRO
IMU_MISO: P1.6 ; off-sheet IMU_MISO
IMU_MOSI: P1.7 ; off-sheet IMU_MOSI
IMU_SCK: P1.8 ; off-sheet IMU_SCK
LIDAR_EN: U6.2(ON) ; off-sheet LIDAR_EN
LIDAR_RX: P2.13 U7.4(C) ; off-sheet LIDAR_RX
LIDAR_TX: P2.12 U7.6(D) ; off-sheet LIDAR_TX
MOT1_DATA: P1.23 U7.1(A) ; off-sheet MOT1_DATA
MOT2_DATA: P3.2 U7.3(B) ; off-sheet MOT2_DATA
VCAM1: C13.2 P2.7 P2.8 U4.5(VOUT) U4.6(VOUT)
VCAM2: C14.2 P2.21 P2.22 U5.5(VOUT) U5.6(VOUT)
VLIDAR: C15.2 P2.11 U6.5(VOUT) U6.6(VOUT)

Not connected (* = marked no-connect by the designer): U4 7(CAP)*; U5 7(CAP)*; U6 7(CAP)*

### Notes on the sheet
- 4MOhm P.D.
- MOTOR
- Designed By:
- Title
- Engineer
- Revision
- Drawn By
- Date
- Sheet
- of

### Library data of the parts
C13-C15 = CAP 0603: Ceramic Capacitor 10uF ±20% 25V X5R 0603; Manufacturer: Murata; Tr: -55:85; Manufacturer P/N: ZRB18AR61E106ME01L; Voltage: 25V; Package: 0603; Tolerance: ±20%
P1 P2 = 0039532244: FPC connector; Manufacturer: Molex; Manufacturer P/N: 0039532244
P3 = Header 3: 2.5mm pitch crimp connector; Manufacturer: JST; Manufacturer P/N: B3B-EH-A
R18-R21 = RES: as R31 on sheet 14-misc; Tolerance: ±0.1%; Manufacturer P/N: ERA-6AEB222V; Package: 0805
U4-U6 = SLG59M611V: High-Side Load Switch; Manufacturer: Silego; Package: WFDFN-8 Silego; Manufacturer P/N: SLG59M611V
U7 = NUP4301MR6: as U8 on sheet 14-misc; Manufacturer P/N: NUP4301MR6

## Sheet 06-modem0.SchDoc: Modem
size Letter; DrawnBy: J. Brinton; Engineer: J. Brinton; Revision: 1; SheetNumber: 6; SheetTotal: 14
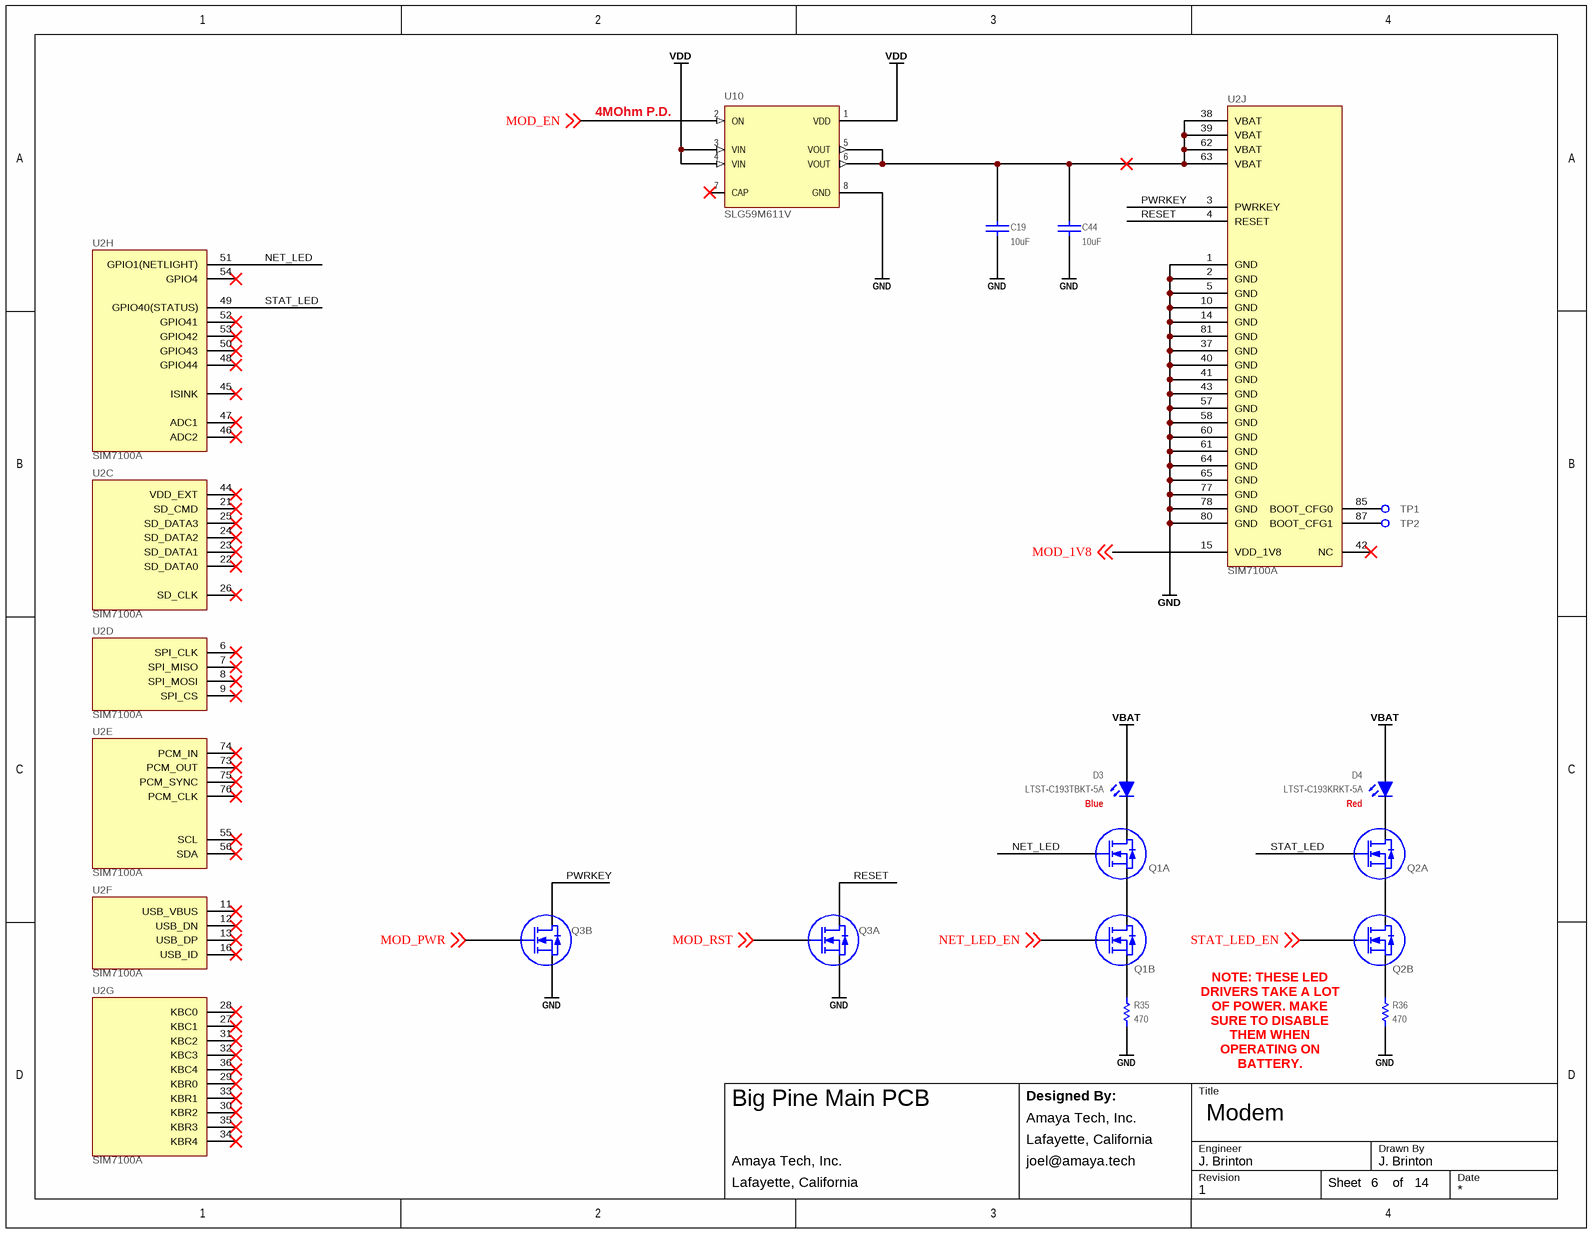
[diagram p7: 06-modem0.SchDoc]

### Parts
C19  value 10uF  [CAPC160X80X90L20N]  (hidden comment: ZRB18AR61E106ME01L)
C44  value 10uF  [CAPC160X80X90L20N]  (hidden comment: ZRB18AR61E106ME01L)
D3  LTST-C193TBKT-5A  [0603_LED]
D4  LTST-C193KRKT-5A  [0603_LED]
Q1  UM6K34NTCN  [SOT363]  (value not drawn)  (parts A,B of 2)
Q2  UM6K34NTCN  [SOT363]  (value not drawn)  (parts A,B of 2)
Q3  UM6K34NTCN  [SOT363]  (value not drawn)  (parts A,B of 2)
R35  value 470  [RESC2012X70N]  (hidden comment: ERJ-6ENF4700V)
R36  value 470  [RESC2012X70N]  (hidden comment: ERJ-6ENF4700V)
TP1  TEST_POINT_SMD_10  [TEST_POINT_SMD_10]  (value not drawn)  (no BOM)
TP2  TEST_POINT_SMD_10  [TEST_POINT_SMD_10]  (value not drawn)  (no BOM)
U2  SIM7100A  [SIM7100A]  (parts C,D,E,F,G,H,J of 10)
U10  SLG59M611V  [DFN200X150X80-8N]

### Nets
GND: C19.1 C44.1 Q3.1(S2) Q3.4(S1) R35.1 R36.1 U2.1(GND) U2.2(GND) U2.5(GND) U2.10(GND) U2.14(GND) U2.37(GND) U2.40(GND) U2.41(GND) U2.43(GND) U2.57(GND) U2.58(GND) U2.60(GND) U2.61(GND) U2.64(GND) U2.65(GND) U2.77(GND) U2.78(GND) U2.80(GND) U2.81(GND) U10.8(GND)
VBAT: D3.1(A) D4.1(A)
VDD: U10.1(VDD) U10.3(VIN) U10.4(VIN)
MOD_1V8: U2.15(VDD_1V8) ; off-sheet MOD_1V8
MOD_EN: U10.2(ON) ; off-sheet MOD_EN
MOD_PWR: Q3.2(G2) ; off-sheet MOD_PWR
MOD_RST: Q3.5(G1) ; off-sheet MOD_RST
NET_LED: Q1.5(G1) U2.51(GPIO1(NETLIGHT))
NET_LED_EN: Q1.2(G2) ; off-sheet NET_LED_EN
PWRKEY: Q3.6(D2) U2.3(PWRKEY)
RESET: Q3.3(D1) U2.4(RESET)
STAT_LED: Q2.5(G1) U2.49(GPIO40(STATUS))
STAT_LED_EN: Q2.2(G2) ; off-sheet STAT_LED_EN
NetC19_2: C19.2 C44.2 U2.38(VBAT) U2.39(VBAT) U2.62(VBAT) U2.63(VBAT) U10.5(VOUT) U10.6(VOUT)
NetD3_2: D3.2(K) Q1.3(D1)
NetD4_2: D4.2(K) Q2.3(D1)
NetQ1_1: Q1.1(S2) R35.2
NetQ1_4: Q1.4(S1) Q1.6(D2)
NetQ2_1: Q2.1(S2) R36.2
NetQ2_4: Q2.4(S1) Q2.6(D2)
NetTP1_1: TP1.1 U2.85(BOOT_CFG0)
NetTP2_1: TP2.1 U2.87(BOOT_CFG1)

Not connected (* = marked no-connect by the designer): U2 6(SPI_CLK)* 7(SPI_MISO)* 8(SPI_MOSI)* 9(SPI_CS)* 11(USB_VBUS)* 12(USB_DN)* 13(USB_DP)* 16(USB_ID)* 21(SD_CMD)* 22(SD_DATA0)* 23(SD_DATA1)* 24(SD_DATA2)* 25(SD_DATA3)* 26(SD_CLK)* 27(KBC1)* 28(KBC0)* 29(KBR0)* 30(KBR2)* 31(KBC2)* 32(KBC3)* 33(KBR1)* 34(KBR4)* 35(KBR3)* 36(KBC4)* 42(NC)* 44(VDD_EXT)* 45(ISINK)* 46(ADC2)* 47(ADC1)* 48(GPIO44)* 50(GPIO43)* 52(GPIO41)* 53(GPIO42)* 54(GPIO4)* 55(SCL)* 56(SDA)* 73(PCM_OUT)* 74(PCM_IN)* 75(PCM_SYNC)* 76(PCM_CLK)*; U10 7(CAP)*

### Notes on the sheet
- 4MOhm P.D.
- Blue
- Red
- (near Q2) NOTE: THESE LED DRIVERS TAKE A LOT OF POWER. MAKE SURE TO DISABLE THEM WHEN OPERATING ON BATTERY.
- Designed By:
- Title
- Engineer
- Revision
- Drawn By
- Date
- Sheet
- of

### Library data of the parts
C19 C44 = CAP 0603: as C13 on sheet 13-connectors; Manufacturer P/N: ZRB18AR61E106ME01L; Voltage: 25V; Package: 0603; Tolerance: ±20%
D3 = LED0603GR: LED, SMT 0603, Color Blue, 5mA, 2.8V; Manufacturer: Lite-On; Manufacturer P/N: LTST-C193TBKT-5A; Package: 0603 Polarized
D4 = LED0603Y: LED, SMT 0603, Color Red, 5mA, 2V; Manufacturer: Lite-On; Manufacturer P/N: LTST-C193KRKT-5A; Package: 0603 Polarized
Q1-Q3 = 2N7002DW-7-F: as Q4 on sheet 14-misc; Manufacturer P/N: UM6K34NTCN; Package: SOT363
R35 R36 = RES 0402: as R29 on sheet 14-misc; Package: 0805; Manufacturer P/N: ERJ-6ENF4700V; Tolerance: ±1%
TP1 TP2 = TEST_POINT_SMD_10: Test Point SMD
U2 = Component_1: Cellular Module; Manufacturer: SIMCOM; Manufacturer P/N: SIM7100A
U10 = SLG59M611V: as U4 on sheet 13-connectors; Package: WFDFN-8 Silego; Manufacturer P/N: SLG59M611V

## Sheet 10-power.SchDoc: Power
size Letter; DrawnBy: J. Brinton; Engineer: J. Brinton; Revision: 1; SheetNumber: 10; SheetTotal: 14
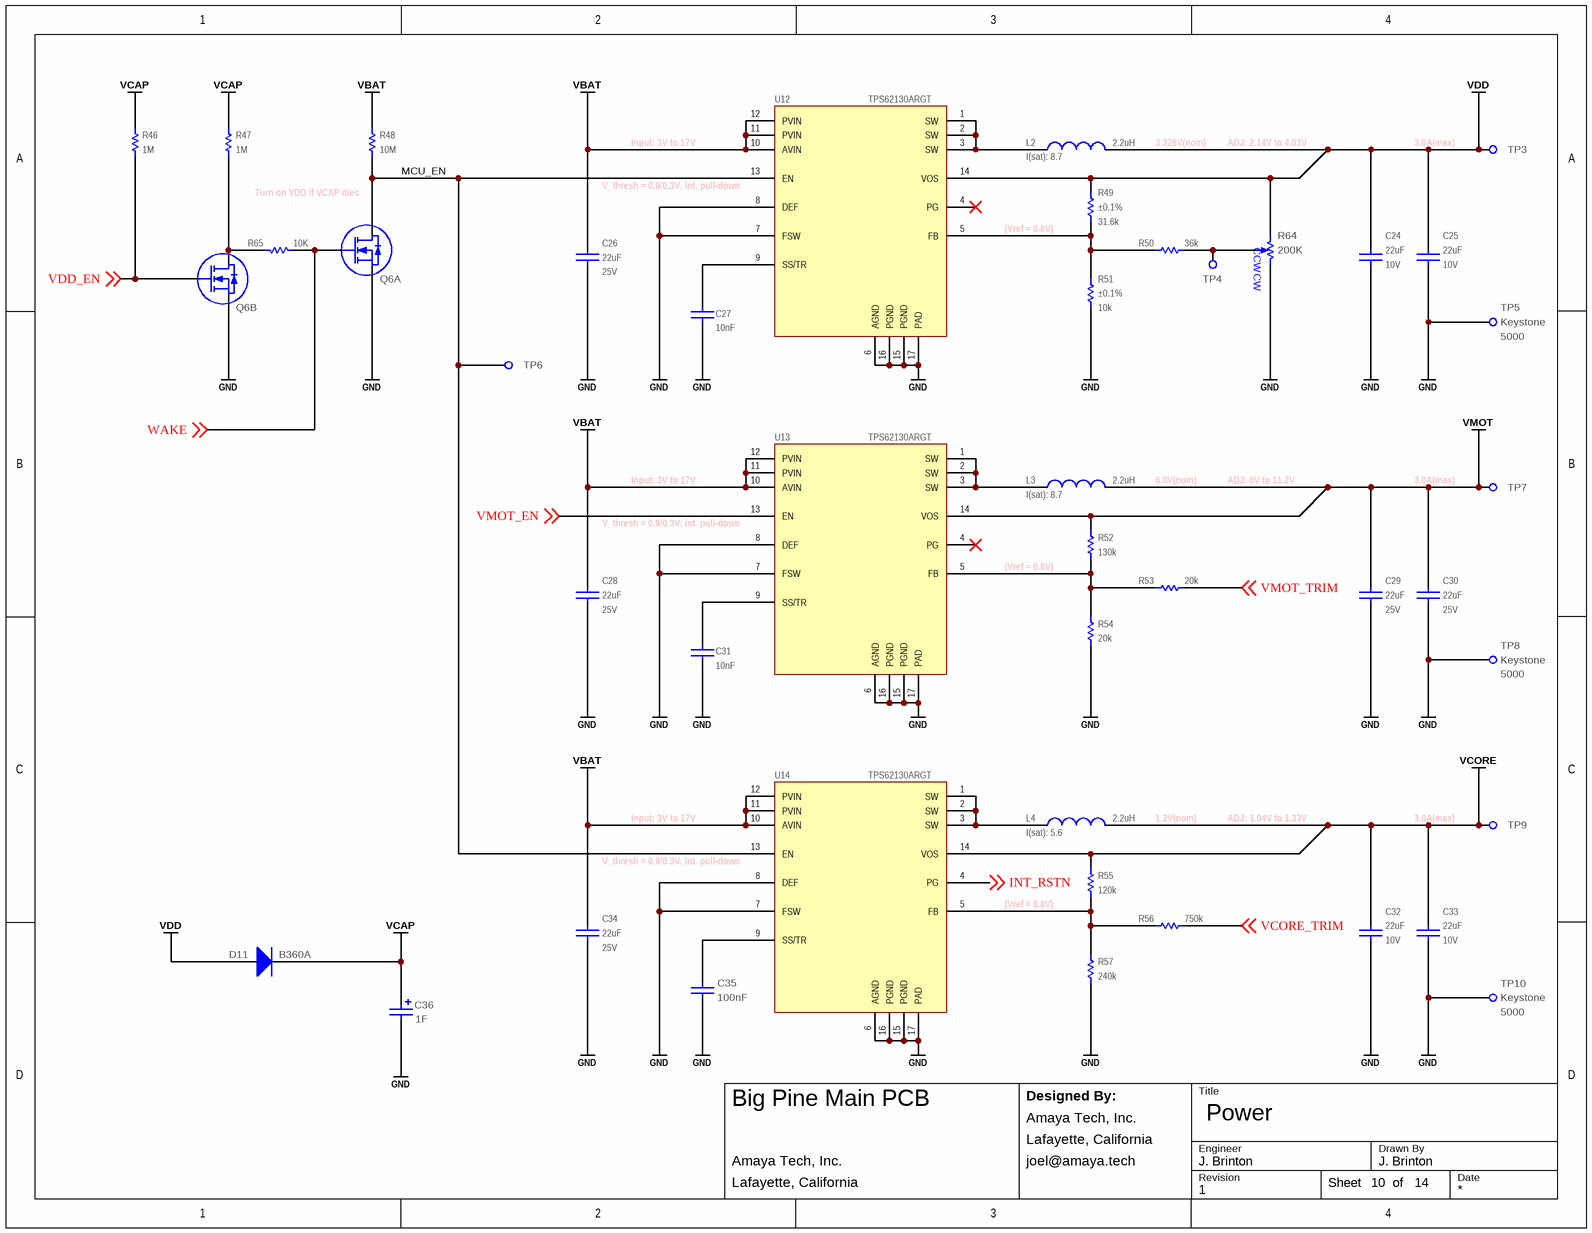
[diagram p8: 10-power.SchDoc]

### Parts
C24  value 22uF  Voltage: 10V  [CAPC200X125X145L45N]  (hidden comment: C2012X7S1A226M125)
C25  value 22uF  Voltage: 10V  [CAPC200X125X145L45N]  (hidden comment: C2012X7S1A226M125)
C26  value 22uF  Voltage: 25V  [CAPC320X250X270L50N]  (hidden comment: GRM32ER71E226KE15)
C27  value 10nF  [CAPC100X50X55L25N]  (hidden comment: GRM155R71H103KA88)
C28  value 22uF  Voltage: 25V  [CAPC320X250X270L50N]  (hidden comment: GRM32ER71E226KE15)
C29  value 22uF  Voltage: 25V  [CAPC320X250X270L50N]  (hidden comment: GRM32ER71E226KE15)
C30  value 22uF  Voltage: 25V  [CAPC320X250X270L50N]  (hidden comment: GRM32ER71E226KE15)
C31  value 10nF  [CAPC100X50X55L25N]  (hidden comment: GRM155R71H103KA88)
C32  value 22uF  Voltage: 10V  [CAPC200X125X145L45N]  (hidden comment: C2012X7S1A226M125)
C33  value 22uF  Voltage: 10V  [CAPC200X125X145L45N]  (hidden comment: C2012X7S1A226M125)
C34  value 22uF  Voltage: 25V  [CAPC320X250X270L50N]  (hidden comment: GRM32ER71E226KE15)
C35  value 100nF  [CAPC200X125X145L45N]  (hidden comment: GCM21BR71H104KA37L)
C36  value 1F  [DBJ-5R5D105T]  (hidden comment: CAP_POL)
D11  B360A  [SMA]
L2  value 2.2uH  I(sat): 8.7  [XAL5030]  (hidden comment: XAL5030-332ME)
L3  value 2.2uH  I(sat): 8.7  [XAL5030]  (hidden comment: XAL5030-332ME)
L4  value 2.2uH  I(sat): 5.6  [XFL4020]  (hidden comment: XAL4020-222ME_)
Q6  2N7002DWQ-7-F  [SOT363]  (value not drawn)  (parts A,B of 2)
R46  value 1M  [RESC2012X70N]  (hidden comment: ERJ-6ENF1004V)
R47  value 1M  [RESC2012X70N]  (hidden comment: ERJ-6ENF1004V)
R48  value 10M  [RESC2012X70N]  (hidden comment: ERJ-6GEYJ106V)
R49  value 31.6k  Tolerance: ±0.1%  [RESC2012X70N]  (hidden comment: ERA-6AEB3162V)
R50  value 36k  [RESC2012X70N]  (hidden comment: ERJ-6ENF3602V)
R51  value 10k  Tolerance: ±0.1%  [RESC2012X70N]  (hidden comment: ERA-6AEB103V)
R52  value 130k  [RESC2012X70N]  (hidden comment: ERJ-6ENF1303V)
R53  value 20k  [RESC2012X70N]  (hidden comment: ERJ-6ENF2002V)
R54  value 20k  [RESC2012X70N]  (hidden comment: ERJ-6ENF2002V)
R55  value 120k  [RESC2012X70N]  (hidden comment: ERJ-6ENF1203V)
R56  value 750k  [RESC2012X70N]  (hidden comment: ERJ-6ENF7502V)
R57  value 240k  [RESC2012X70N]  (hidden comment: ERJ-6ENF2403V)
R64  value 200K  [PVG3A]  (hidden comment: PVG3A204C01R00)
R65  value 10K  [RESC2012X70N]  (hidden comment: ERJ-6ENF1002V)
TP3  TEST_POINT_SMD_50  [TEST_POINT_SMD_50]  (value not drawn)  (no BOM)
TP4  TEST_POINT_SMD_50  [TEST_POINT_SMD_50]  (value not drawn)  (no BOM)
TP5  5000  Manufacturer: Keystone  [TEST_POINT]
TP6  TEST_POINT_SMD_50  [TEST_POINT_SMD_50]  (value not drawn)  (no BOM)
TP7  TEST_POINT_SMD_50  [TEST_POINT_SMD_50]  (value not drawn)  (no BOM)
TP8  5000  Manufacturer: Keystone  [TEST_POINT]
TP9  TEST_POINT_SMD_50  [TEST_POINT_SMD_50]  (value not drawn)  (no BOM)
TP10  5000  Manufacturer: Keystone  [TEST_POINT]
U12  TPS62130ARGT  [S-PQFP-8N]
U13  TPS62130ARGT  [S-PQFP-8N]
U14  TPS62130ARGT  [S-PQFP-8N]

### Nets
GND: C24.1 C25.1 C26.1 C27.2 C28.1 C29.1 C30.1 C31.2 C32.1 C33.1 C34.1 C35.2 C36.2 Q6.1(S2) Q6.4(S1) R51.1 R54.1 R57.1 R64.3(CW) TP5.1 TP8.1 TP10.1 U12.6(AGND) U12.7(FSW) U12.8(DEF) U12.15(PGND) U12.16(PGND) U12.17(PAD) U13.6(AGND) U13.7(FSW) U13.8(DEF) U13.15(PGND) U13.16(PGND) U13.17(PAD) U14.6(AGND) U14.7(FSW) U14.8(DEF) U14.15(PGND) U14.16(PGND) U14.17(PAD)
VBAT: C26.2 C28.2 C34.2 R48.2 U12.10(AVIN) U12.11(PVIN) U12.12(PVIN) U13.10(AVIN) U13.11(PVIN) U13.12(PVIN) U14.10(AVIN) U14.11(PVIN) U14.12(PVIN)
VCAP: C36.1 D11.2(K) R46.2 R47.2
VCORE: C32.2 C33.2 L4.2 R55.2 TP9.1 U14.14(VOS)
VDD: C24.2 C25.2 D11.1(A) L2.2 R49.2 R64.1(CCW) TP3.1 U12.14(VOS)
VMOT: C29.2 C30.2 L3.2 R52.2 TP7.1 U13.14(VOS)
INT_RSTN: U14.4(PG) ; off-sheet INT_RSTN
MCU_EN: Q6.3(D1) R48.1 TP6.1 U12.13(EN) U14.13(EN)
VCORE_TRIM: R56.1 ; off-sheet VCORE_TRIM
VDD_EN: Q6.2(G2) R46.1 ; off-sheet VDD_EN
VMOT_EN: U13.13(EN) ; off-sheet VMOT_EN
VMOT_TRIM: R53.1 ; off-sheet VMOT_TRIM
WAKE: Q6.5(G1) R65.1 ; off-sheet WAKE
NetC27_1: C27.1 U12.9(SS/TR)
NetC31_1: C31.1 U13.9(SS/TR)
NetC35_1: C35.1 U14.9(SS/TR)
NetL2_1: L2.1 U12.1(SW) U12.2(SW) U12.3(SW)
NetL3_1: L3.1 U13.1(SW) U13.2(SW) U13.3(SW)
NetL4_1: L4.1 U14.1(SW) U14.2(SW) U14.3(SW)
NetQ6_6: Q6.6(D2) R47.1 R65.2
NetR49_1: R49.1 R50.2 R51.2 U12.5(FB)
NetR50_1: R50.1 R64.2(CT) TP4.1
NetR52_1: R52.1 R53.2 R54.2 U13.5(FB)
NetR55_1: R55.1 R56.2 R57.2 U14.5(FB)

Not connected (* = marked no-connect by the designer): U12 4(PG)*; U13 4(PG)*

### Notes on the sheet
- Input: 3V to 17V
- 3.328V(nom)
- ADJ: 2.14V to 4.03V
- (near TP3) 3.0A(max)
- Turn on VDD if VCAP dies
- (near U12) V_thresh = 0.9/0.3V, int. pull-down
- (near R49) (Vref = 0.8V)
- (near U13) V_thresh = 0.9/0.3V, int. pull-down
- 6.0V(nom)
- ADJ: 0V to 11.2V
- (near TP7) 3.0A(max)
- (near R52) (Vref = 0.8V)
- 1.2V(nom)
- ADJ: 1.04V to 1.33V
- (near TP9) 3.0A(max)
- (near U14) V_thresh = 0.9/0.3V, int. pull-down
- (near R55) (Vref = 0.8V)
- Designed By:
- Title
- Engineer
- Revision
- Drawn By
- Date
- Sheet
- of

### Library data of the parts
C24 C25 C32 C33 = CAP: Ceramic Capacitor 22uF ±20% 10V X7S 0805; Manufacturer: TDK; Tr: -55:125; Manufacturer P/N: C2012X7S1A226M125; Tolerance: ±20%; Package: 0805
C26 C28-C30 C34 = CAP: Ceramic Capacitor 22uF ±10% 25V X7R 1210; Manufacturer: Murata; Tr: -55:125; Manufacturer P/N: GRM32ER71E226KE15; Tolerance: ±10%; Package: 1210
C27 C31 = CAP: Ceramic Capacitor 10nF ±10% 50V X7R 0402; Manufacturer: Murata; Tr: -55:125; Manufacturer P/N: GRM155R71H103KA88; Tolerance: ±10%; Voltage: 50V; Package: 0402
C35 = TMK212B7105KG: as C18 on sheet 14-misc; Manufacturer P/N: GCM21BR71H104KA37L; Tolerance: ±10%; Package: 0805; Voltage: 50V
C36 = CAP_POL: Super Capacitor 1F 5.5V Leaded; Manufacturer: Elna; Manufacturer P/N: DBJ-5R5D105T; Voltage: 5.5V
D11 = D360A: DIODE SCHOTTKY 60V 3A SMA; Manufacturer: Diodes Inc; Tr: -55:150; Manufacturer P/N: B360A; Current: 3A; Reverse Voltage (max): 60V; Package: SMA
L2 L3 = INDUCTOR: Shielded Power Inductor 2.2uH, 8.7A; Manufacturer: Coilcraft; Manufacturer P/N: XAL5030-332ME
L4 = INDUCTOR: Shielded Power Inductor 2.2uH, 5.6A; Manufacturer: Coilcraft; Manufacturer P/N: XAL4020-222ME
Q6 = 2N7002DW-7-F: Dual N-Channel Enhancement Mode MOSFET; Manufacturer: Diodes, Inc.; Tr: -55:150; Manufacturer P/N: 2N7002DWQ-7-F; Package: SOT363
R46 R47 = RES 0402: as R1 on sheet 03-mcu1; Package: 0805; Manufacturer P/N: ERJ-6ENF1004V; Tolerance: ±1%
R48 = RES 0402: Thick Film Resistor 10M ±1% 0805; Manufacturer: Panasonic; Tolerance: ±5%; Tr: -55:155; Package: 0805; Manufacturer P/N: ERJ-6GEYJ106V
R49 = RES: Thin Film Resistor 31.6k ±0.1% 0.125W 100V 0805; Manufacturer: Panasonic; Tcr: ±25; Tr: -55:155; Voltage: 100; Power: 0.125; Manufacturer P/N: ERA-6AEB3162V; Package: 0805
R50 = RES 0402: Thick Film Resistor 36k ±1% 0805; Manufacturer: Panasonic; Tr: -55:155; Package: 0805; Manufacturer P/N: ERJ-6ENF3602V; Tolerance: ±1%
R51 = RES: as R22 on sheet 14-misc; Manufacturer P/N: ERA-6AEB103V; Package: 0805
R52 = RES 0402: Thick Film Resistor 130k ±1% 0805; Manufacturer: Panasonic; Tr: -55:155; Package: 0805; Manufacturer P/N: ERJ-6ENF1303V; Tolerance: ±1%
R53 R54 = RES 0402: Thick Film Resistor 20k ±1% 0805; Manufacturer: Panasonic; Tr: -55:155; Package: 0805; Manufacturer P/N: ERJ-6ENF2002V; Tolerance: ±1%
R55 = RES 0402: Thick Film Resistor 120k ±1% 0805; Manufacturer: Panasonic; Tr: -55:155; Package: 0805; Manufacturer P/N: ERJ-6ENF1203V; Tolerance: ±1%
R56 = RES 0402: Thick Film Resistor 750k ±1% 0805; Manufacturer: Panasonic; Tr: -55:155; Package: 0805; Manufacturer P/N: ERJ-6ENF7502V; Tolerance: ±1%
R57 = RES 0402: Thick Film Resistor 240k ±1% 0805; Manufacturer: Panasonic; Tr: -55:155; Package: 0805; Manufacturer P/N: ERJ-6ENF2403V; Tolerance: ±1%
R64 = PVG3A204C01R00: Trimmer 200K, sealed, cermet; Manufacturer: Murata; Manufacturer P/N: PVG3A204C01R00
R65 = RES 0402: as R10 on sheet 05-mcu3; Package: 0805; Manufacturer P/N: ERJ-6ENF1002V; Tolerance: ±1%
TP3 TP4 TP6 TP7 TP9 = TEST_POINT_SMD_50: Test Point SMD
TP5 TP8 TP10 = TEST_POINT: Thruhole Miniature Test Point; Manufacturer P/N: 5000; Do Not Place: *
U12-U14 = TPS62130RGT: 3-17V 3A Step-Down Converter VQFN; Manufacturer: Texas Instruments; Manufacturer P/N: TPS62130ARGT

## Sheet 11-mppt.SchDoc: MPPT
size Letter; DrawnBy: J. Brinton; Engineer: J. Brinton; Revision: 1; SheetNumber: 11; SheetTotal: 14
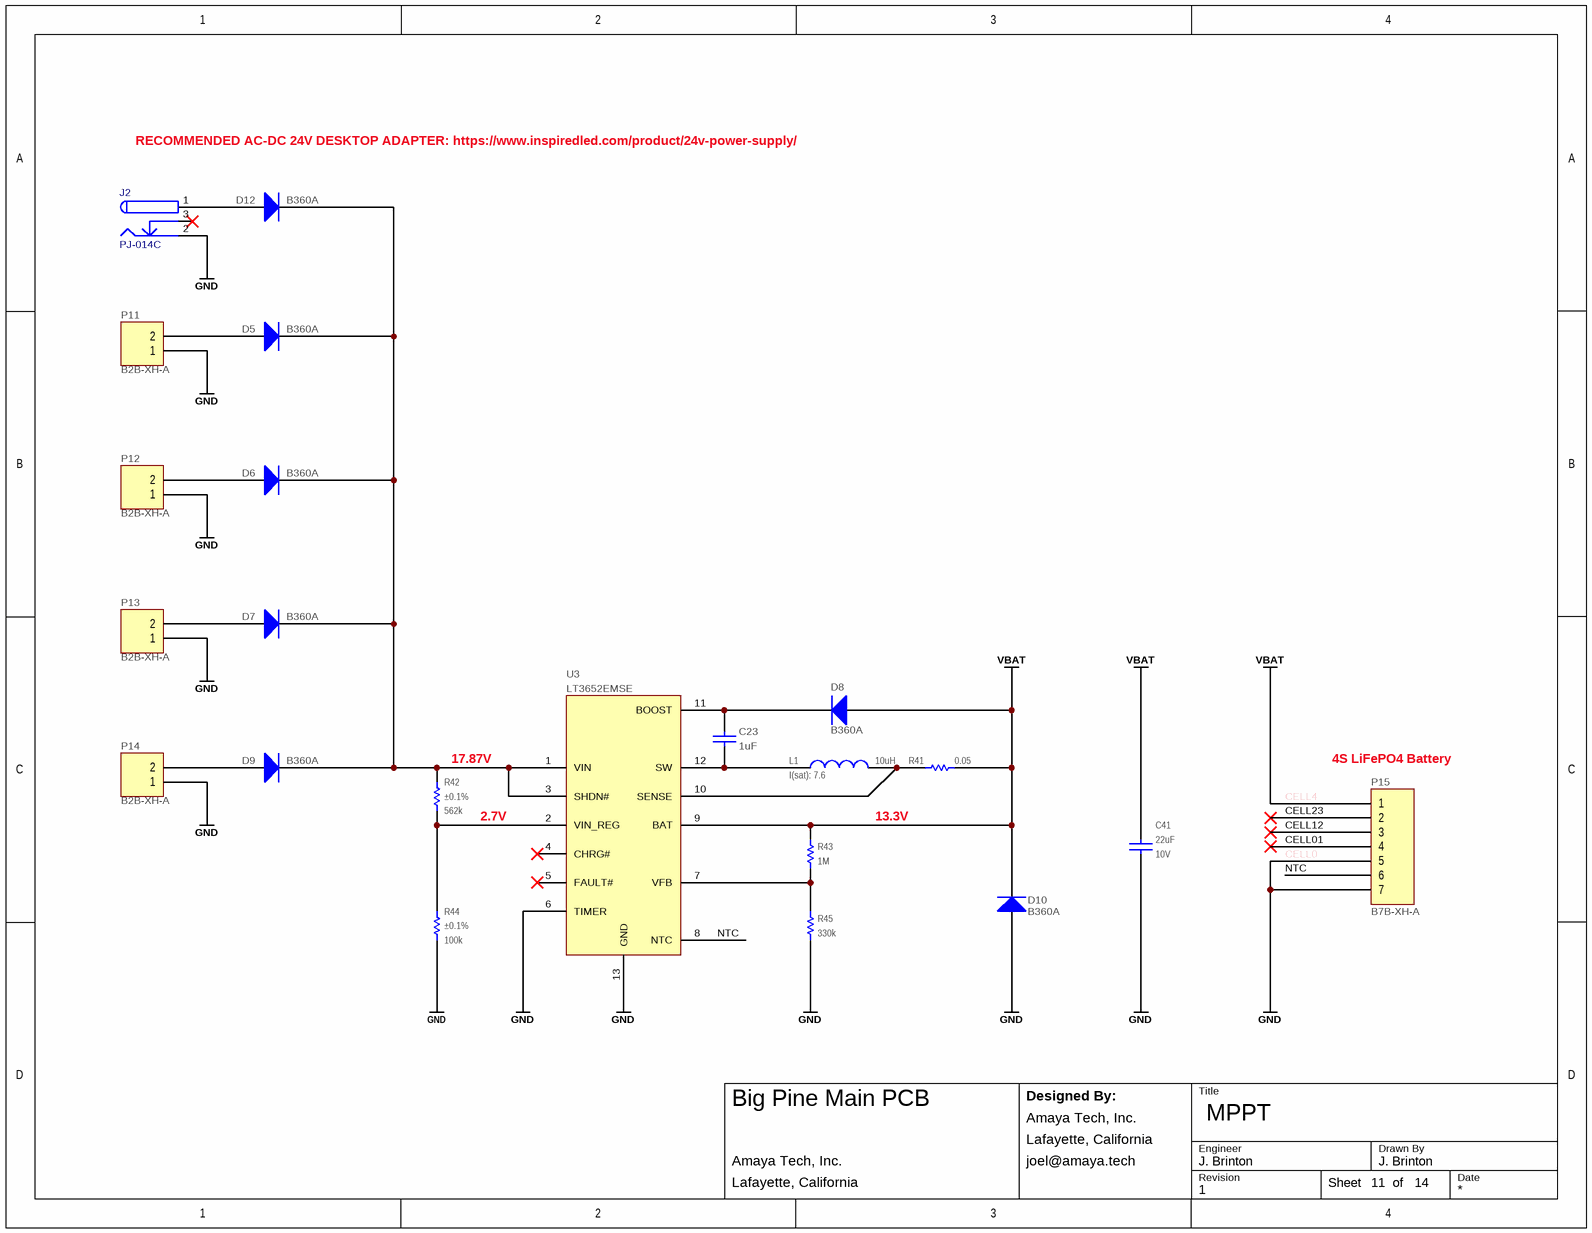
[diagram p9: 11-mppt.SchDoc]

### Parts
C23  value 1uF  [CAPC200X125X145L45N]  (hidden comment: TMK212B7105KG)
C41  value 22uF  Voltage: 10V  [CAPC200X125X145L45N]  (hidden comment: C2012X7S1A226M125)
D5  B360A  [SMA]
D6  B360A  [SMA]
D7  B360A  [SMA]
D8  B360A  [SMA]
D9  B360A  [SMA]
D10  B360A  [SMA]
D12  B360A  [SMA]
J2  PJ-014C  [PJ-014C]
L1  value 10uH  I(sat): 7.6  [XAL6030]  (hidden comment: XAL6030-103ME)
P11  B2B-XH-A  [B2B-XH-A]
P12  B2B-XH-A  [B2B-XH-A]
P13  B2B-XH-A  [B2B-XH-A]
P14  B2B-XH-A  [B2B-XH-A]
P15  B7B-XH-A  [B7B-XH-A]
R41  value 0.05  [RESC2012X70N]  (hidden comment: ERJ-6BWFR050V)
R42  value 562k  Tolerance: ±0.1%  [RESC2012X70N]  (hidden comment: ERA-6AEB5623V)
R43  value 1M  [RESC2012X70N]  (hidden comment: ERJ-6ENF1004V)
R44  value 100k  Tolerance: ±0.1%  [RESC2012X70N]  (hidden comment: ERA-6AEB104V)
R45  value 330k  [RESC2012X70N]  (hidden comment: ERJ-6ENF3303V)
U3  LT3652EMSE  [12-MSOP-EP]

### Nets
GND: C41.1 D10.1(A) J2.2 P11.1 P12.1 P13.1 P14.1 P15.5 P15.7 R44.1 R45.1 U3.6(TIMER) U3.13(GND)
VBAT: C41.2 D8.1(A) D10.2(K) P15.1 R41.1 R43.2 U3.9(BAT)
CELL01: P15.4
CELL12: P15.3
CELL23: P15.2
NTC: P15.6 U3.8(NTC)
NetC23_1: C23.1 D8.2(K) U3.11(BOOST)
NetC23_2: C23.2 L1.1 U3.12(SW)
NetD5_1: D5.1(A) P11.2
NetD5_2: D5.2(K) D6.2(K) D7.2(K) D9.2(K) D12.2(K) R42.2 U3.1(VIN) U3.3(SHDN#)
NetD6_1: D6.1(A) P12.2
NetD7_1: D7.1(A) P13.2
NetD9_1: D9.1(A) P14.2
NetD12_1: D12.1(A) J2.1
NetL1_2: L1.2 R41.2 U3.10(SENSE)
NetR42_1: R42.1 R44.2 U3.2(VIN_REG)
NetR43_1: R43.1 R45.2 U3.7(VFB)

Not connected (* = marked no-connect by the designer): J2 3*; U3 4(CHRG#)* 5(FAULT#)*

### Notes on the sheet
- RECOMMENDED AC-DC 24V DESKTOP ADAPTER: https://www.inspiredled.com/product/24v-power-supply/
- (near R42) 17.87V
- 2.7V
- 13.3V
- CELL4
- (near P15) 4S LiFePO4 Battery
- CELL0
- Designed By:
- Title
- Engineer
- Revision
- Drawn By
- Date
- Sheet
- of

### Library data of the parts
C23 = TMK212B7105KG: Ceramic Capacitor 1uF ±10% 25V X7R 0805; Manufacturer: Taiyo Yuden; Tr: -55:125; Manufacturer P/N: TMK212B7105KG; Tolerance: ±10%; Package: 0805; Voltage: 25V
C41 = CAP: as C24 on sheet 10-power; Manufacturer P/N: C2012X7S1A226M125; Tolerance: ±20%; Package: 0805
D5-D10 D12 = D360A: as D11 on sheet 10-power; Manufacturer P/N: B360A; Current: 3A; Reverse Voltage (max): 60V; Package: SMA
J2 = PJ-014C: DC Power Jack; Manufacturer: CUI; ComponentLink1Description: Manufacturer Link; ComponentLink1URL: http://domino.kycon.com/internet/Products.html; Manufacturer P/N: PJ-014C
L1 = INDUCTOR: Shielded Power Inductor 10uH, 7.6A; Manufacturer: Coilcraft; Manufacturer P/N: XAL6030-103ME
P11-P14 = Header 2: Header, 2-Pin; Manufacturer: JST; Manufacturer P/N: B2B-XH-A
P15 = Header 7: Header, 7-Pin; Manufacturer: JST; Manufacturer P/N: B7B-XH-A
R41 = RES 0402: Thick Film Resistor 0.05 ±1% 0805; Manufacturer: Panasonic; Tr: -55:155; Package: 0805; Manufacturer P/N: ERJ-6BWFR050V; Tolerance: ±1%
R42 = RES: Thin Film Resistor 562k ±0.1% 0.125W 100V 0805; Manufacturer: Panasonic; Tcr: ±25; Tr: -55:155; Voltage: 100; Power: 0.125; Manufacturer P/N: ERA-6AEB5623V; Package: 0805
R43 = RES 0402: as R1 on sheet 03-mcu1; Package: 0805; Manufacturer P/N: ERJ-6ENF1004V; Tolerance: ±1%
R44 = RES: Thin Film Resistor 100k ±0.1% 0.125W 100V 0805; Manufacturer: Panasonic; Tcr: ±25; Tr: -55:155; Voltage: 100; Power: 0.125; Manufacturer P/N: ERA-6AEB104V; Package: 0805
R45 = RES 0402: Thick Film Resistor 330k ±1% 0805; Manufacturer: Panasonic; Tr: -55:155; Package: 0805; Manufacturer P/N: ERJ-6ENF3303V; Tolerance: ±1%
U3 = LT3652EMSE: Power Tracking 2A Battery Charger for Solar Power; Manufacturer: Analog Devices; Manufacturer P/N: LT3652EMSE

## Sheet 12-sdcard.SchDoc: SDCard
size Letter; DrawnBy: J. Brinton; Engineer: J. Brinton; Revision: 1; SheetNumber: 12; SheetTotal: 14
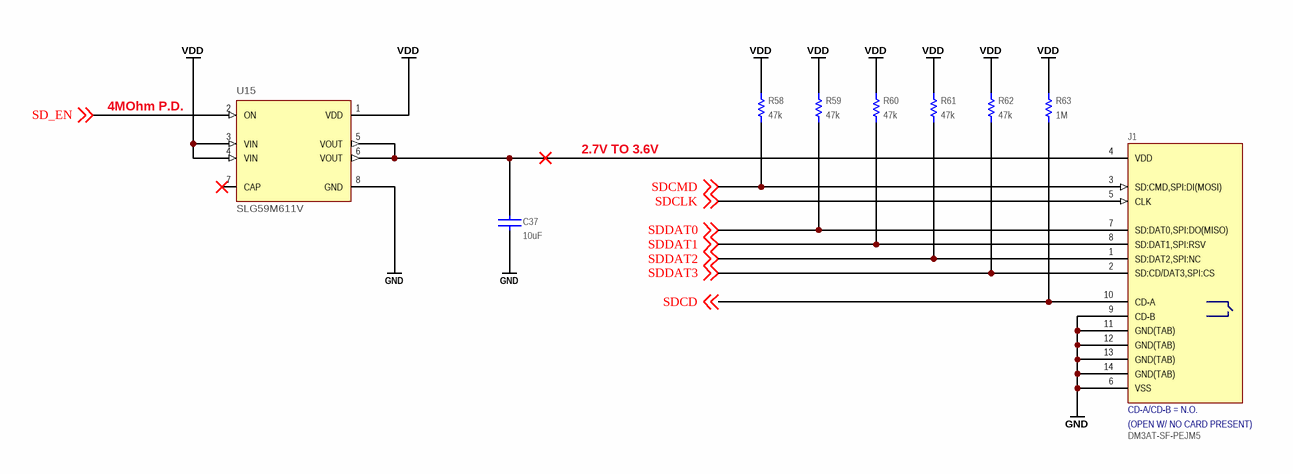
[diagram p10: 12-sdcard.SchDoc]

### Parts
C37  value 10uF  [CAPC160X80X90L20N]  (hidden comment: ZRB18AR61E106ME01L)
J1  DM3AT-SF-PEJM5  [DM3AT-SF-PEJM5]
R58  value 47k  [RESC2012X70N]  (hidden comment: ERJ-6ENF4702V)
R59  value 47k  [RESC2012X70N]  (hidden comment: ERJ-6ENF4702V)
R60  value 47k  [RESC2012X70N]  (hidden comment: ERJ-6ENF4702V)
R61  value 47k  [RESC2012X70N]  (hidden comment: ERJ-6ENF4702V)
R62  value 47k  [RESC2012X70N]  (hidden comment: ERJ-6ENF4702V)
R63  value 1M  [RESC2012X70N]  (hidden comment: ERJ-6ENF1004V)
U15  SLG59M611V  [DFN200X150X80-8N]

### Nets
GND: C37.1 J1.6(VSS) J1.9(CD-B) J1.11(GND(TAB)) J1.12(GND(TAB)) J1.13(GND(TAB)) J1.14(GND(TAB)) U15.8(GND)
VDD: R58.2 R59.2 R60.2 R61.2 R62.2 R63.2 U15.1(VDD) U15.3(VIN) U15.4(VIN)
SD_EN: U15.2(ON) ; off-sheet SD_EN
SDCD: J1.10(CD-A) R63.1 ; off-sheet SDCD
SDCLK: J1.5(CLK) ; off-sheet SDCLK
SDCMD: J1.3(SD:CMD,SPI:DI(MOSI)) R58.1 ; off-sheet SDCMD
SDDAT0: J1.7(SD:DAT0,SPI:DO(MISO)) R59.1 ; off-sheet SDDAT0
SDDAT1: J1.8(SD:DAT1,SPI:RSV) R60.1 ; off-sheet SDDAT1
SDDAT2: J1.1(SD:DAT2,SPI:NC) R61.1 ; off-sheet SDDAT2
SDDAT3: J1.2(SD:CD/DAT3,SPI:CS) R62.1 ; off-sheet SDDAT3
NetC37_2: C37.2 J1.4(VDD) U15.5(VOUT) U15.6(VOUT)

Not connected (* = marked no-connect by the designer): U15 7(CAP)*

### Notes on the sheet
- 4MOhm P.D.
- 2.7V TO 3.6V
- Designed By:
- Title
- Engineer
- Revision
- Drawn By
- Date
- Sheet
- of
- (in symbol DM3AT-SF-PEJM5) CD-A/CD-B = N.O.; (OPEN W/ NO CARD PRESENT)

### Library data of the parts
C37 = CAP 0603: as C13 on sheet 13-connectors; Manufacturer P/N: ZRB18AR61E106ME01L; Voltage: 25V; Package: 0603; Tolerance: ±20%
J1 = DM3AT-SF-PEJM5: Micro SD Card Connector, R/A; Manufacturer: Hirose; Manufacturer P/N: DM3AT-SF-PEJM5
R58-R62 = RES 0402: Thick Film Resistor 47k ±1% 0805; Manufacturer: Panasonic; Tr: -55:155; Package: 0805; Manufacturer P/N: ERJ-6ENF4702V; Tolerance: ±1%
R63 = RES 0402: as R1 on sheet 03-mcu1; Package: 0805; Manufacturer P/N: ERJ-6ENF1004V; Tolerance: ±1%
U15 = SLG59M611V: as U4 on sheet 13-connectors; Package: WFDFN-8 Silego; Manufacturer P/N: SLG59M611V

## Sheet 07-modem1.SchDoc: Modem
size Letter; DrawnBy: J. Brinton; Engineer: J. Brinton; Revision: 1; SheetNumber: 7; SheetTotal: 14
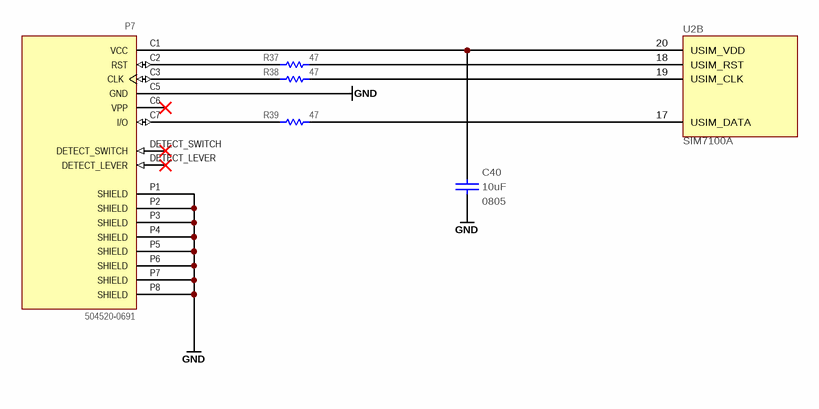
[diagram p11: 07-modem1.SchDoc]

### Parts
C40  value 10uF  Package: 0805  [CAPC200X125X145L45N]  (hidden comment: CL21B106KOQNNNE)
P7  504520-0691  [504520-0691]
R37  value 47  [RESC2012X70N]  (hidden comment: ERJ-6ENF47R0V)
R38  value 47  [RESC2012X70N]  (hidden comment: ERJ-6ENF47R0V)
R39  value 47  [RESC2012X70N]  (hidden comment: ERJ-6ENF47R0V)
U2  SIM7100A  [SIM7100A]  (part B of 10)

### Nets
GND: C40.2 P7.C5(GND) P7.P1(SHIELD) P7.P2(SHIELD) P7.P3(SHIELD) P7.P4(SHIELD) P7.P5(SHIELD) P7.P6(SHIELD) P7.P7(SHIELD) P7.P8(SHIELD)
NetC40_1: C40.1 P7.C1(VCC) U2.20(USIM_VDD)
NetP7_C2: P7.C2(RST) R37.2
NetP7_C3: P7.C3(CLK) R38.2
NetP7_C7: P7.C7(I/O) R39.2
NetR37_1: R37.1 U2.18(USIM_RST)
NetR38_1: R38.1 U2.19(USIM_CLK)
NetR39_1: R39.1 U2.17(USIM_DATA)

Not connected (* = marked no-connect by the designer): P7 C6(VPP)* DETECT_LEVER* DETECT_SWITCH*

### Notes on the sheet
- Designed By:
- Title
- Engineer
- Revision
- Drawn By
- Date
- Sheet
- of

### Library data of the parts
C40 = LMK212B7106KG: as C1 on sheet 02-mcu0; Manufacturer P/N: CL21B106KOQNNNE; Tolerance: ±10%; Voltage: 16V
P7 = 504520-0691: micro-SIM Card Connector; Manufacturer: Molex; Availability: Good; Package: None; Manufacturer P/N: 504520-0691; Price: 1.31 USD; Value: *
R37-R39 = RES 0402: Thick Film Resistor 47 ±1% 0805; Manufacturer: Panasonic; Tr: -55:155; Package: 0805; Manufacturer P/N: ERJ-6ENF47R0V; Tolerance: ±1%
U2 = Component_1: Cellular Module; Manufacturer: SIMCOM; Manufacturer P/N: SIM7100A

## Sheet 08-modem2.SchDoc: Modem
size Letter; DrawnBy: J. Brinton; Engineer: J. Brinton; Revision: 1; SheetNumber: 8; SheetTotal: 14
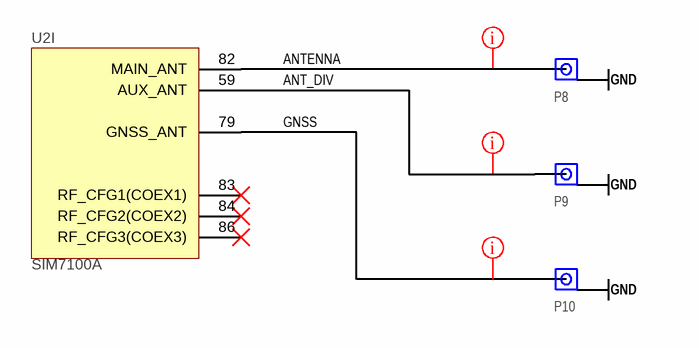
[diagram p12: 08-modem2.SchDoc]

### Parts
P8  U.FL-R-SMT(10)  [U.FL-R-SMT(10)]  (value not drawn)
P9  U.FL-R-SMT(10)  [U.FL-R-SMT(10)]  (value not drawn)
P10  U.FL-R-SMT(10)  [U.FL-R-SMT(10)]  (value not drawn)
U2  SIM7100A  [SIM7100A]  (part I of 10)

### Nets
GND: P8.2(GND) P9.2(GND) P10.2(GND)
ANT_DIV: P9.1(RF) U2.59(AUX_ANT)
ANTENNA: P8.1(RF) U2.82(MAIN_ANT)
GNSS: P10.1(RF) U2.79(GNSS_ANT)

Not connected (* = marked no-connect by the designer): U2 83(RF_CFG1(COEX1))* 84(RF_CFG2(COEX2))* 86(RF_CFG3(COEX3))*

### Layout directives
net class RF: ANT_DIV, ANTENNA, GNSS

### Notes on the sheet
- Designed By:
- Title
- Engineer
- Revision
- Drawn By
- Date
- Sheet
- of

### Library data of the parts
P8-P10 = U.FL-R-SMT(10): Ultra Miniature Coaxial Jack, 50 Ohms; Manufacturer: Hirose; Manufacturer P/N: U.FL-R-SMT(10)
U2 = Component_1: Cellular Module; Manufacturer: SIMCOM; Manufacturer P/N: SIM7100A

## Sheet 09-modem3.SchDoc: Modem
size Letter; DrawnBy: J. Brinton; Engineer: J. Brinton; Revision: 1; SheetNumber: 9; SheetTotal: 14
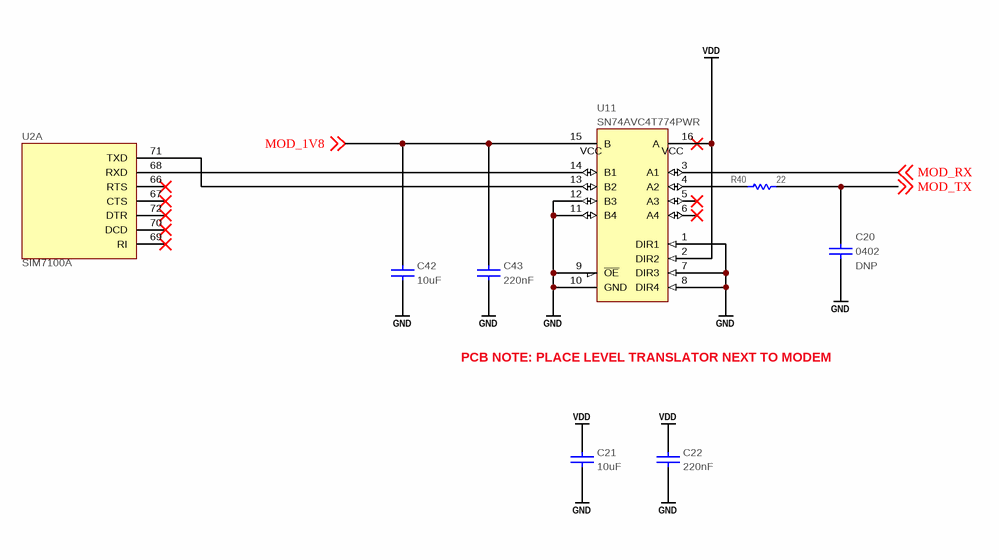
[diagram p13: 09-modem3.SchDoc]

### Parts
C20  Package: 0402  Do Not Place: DNP  [CAPC100X50X55L25N]  (hidden comment: VJ0402A101KXA)
C21  value 10uF  [CAPC200X125X145L45N]  (hidden comment: CL21B106KOQNNNE)
C22  value 220nF  [CAPC100X50X55L25N]  (hidden comment: C1005X7R1E224K050BE)
C42  value 10uF  [CAPC200X125X145L45N]  (hidden comment: CL21B106KOQNNNE)
C43  value 220nF  [CAPC100X50X55L25N]  (hidden comment: C1005X7R1E224K050BE)
R40  value 22  [RESC2012X70N]  (hidden comment: ERJ-6ENF22R0V)
U2  SIM7100A  [SIM7100A]  (part A of 10)
U11  SN74AVC4T774PWR  [TSSOP16]

### Nets
GND: C20.2 C21.2 C22.2 C42.2 C43.2 U11.1(DIR1) U11.7(DIR3) U11.8(DIR4) U11.9(~{OE}) U11.10(GND) U11.11(B4) U11.12(B3)
VDD: C21.1 C22.1 U11.2(DIR2) U11.16(A)
MOD_1V8: C42.1 C43.1 U11.15(B) ; off-sheet MOD_1V8
MOD_RX: U11.3(A1) ; off-sheet MOD_RX
MOD_TX: C20.1 R40.1 ; off-sheet MOD_TX
NetR40_2: R40.2 U11.4(A2)
NetU2_68: U2.68(RXD) U11.14(B1)
NetU2_71: U2.71(TXD) U11.13(B2)

Not connected (* = marked no-connect by the designer): U2 66(RTS)* 67(CTS)* 69(RI)* 70(DCD)* 72(DTR)*; U11 5(A3)* 6(A4)*

### Notes on the sheet
- PCB NOTE: PLACE LEVEL TRANSLATOR NEXT TO MODEM
- Designed By:
- Title
- Engineer
- Revision
- Drawn By
- Date
- Sheet
- of
- (in symbol SN74AVC4T774PWR) VCC

### Library data of the parts
C20 = VJ0402A101JXA: Ceramic Capacitor 100pF ±10% 50V C0G 0402; Manufacturer: Vishay; Tr: -55:150; Manufacturer P/N: VJ0402A101KXA; Tolerance: ±10%; Value: 100pF; Voltage: 50V
C21 C42 = LMK212B7106KG: as C1 on sheet 02-mcu0; Manufacturer P/N: CL21B106KOQNNNE; Tolerance: ±10%; Package: 0805; Voltage: 16V
C22 C43 = TMK105B7224KV: Ceramic Capacitor 220nF ±10% 25V X7R 0402; Manufacturer: TDK; Manufacturer P/N: C1005X7R1E224K050BE; Tolerance: ±10%; Tr: *; Package: 0402; Voltage: 25V
R40 = RES 0402: as R2 on sheet 03-mcu1; Package: 0805; Manufacturer P/N: ERJ-6ENF22R0V; Tolerance: ±1%
U2 = Component_1: Cellular Module; Manufacturer: SIMCOM; Manufacturer P/N: SIM7100A
U11 = SN74AVC4T774PWR: 4-Bit Dual-Supply Bus Transceiver; Manufacturer: Texas Instruments; Manufacturer P/N: SN74AVC4T774PWR